# Altium project 6DOF_CONTROLLER.PrjPcb (part 2 of 2)

## Sheet MOTOR_DRIVER_CEC.SchDoc
size A4; SheetNumber: 7; SheetTotal: 12
Used 6 times, as channels U_MOTOR_DRIVER_CEC, U_MOTOR_DRIVER_CEC, U_MOTOR_DRIVER_CEC, U_MOTOR_DRIVER_CEC, U_MOTOR_DRIVER_CEC, U_MOTOR_DRIVER_CEC. Parts and nets are listed once, with the designators drawn on the sheet.
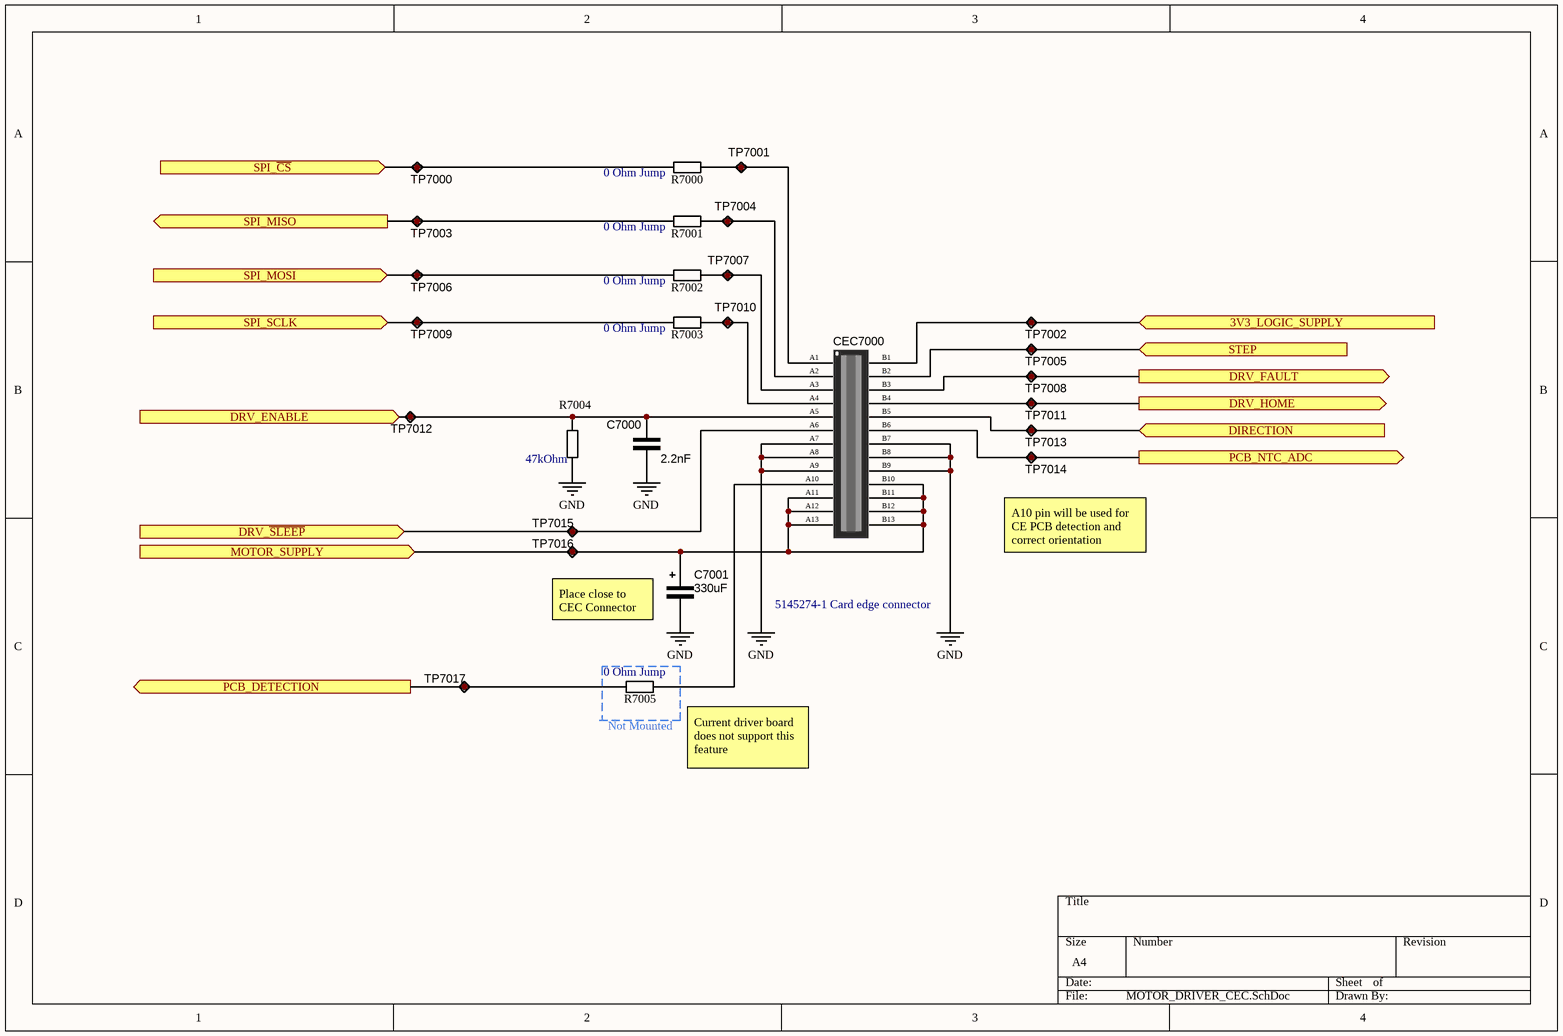
[diagram p9: MOTOR_DRIVER_CEC.SchDoc]

### Parts
C7000  2.2nF  [CAP_0603]
C7001  330uF  [CAPAE109103X103M]
CEC7000  5145274-1 Card edge connector  [5145274-1]
R7000  0 Ohm Jump  [RES_0603]
R7001  0 Ohm Jump  [RES_0603]
R7002  0 Ohm Jump  [RES_0603]
R7003  0 Ohm Jump  [RES_0603]
R7004  47kOhm  [RES_0603]
R7005  0 Ohm Jump  [RES_0603]
TP7000  Test point  [TestPoint]  (value not drawn)
TP7001  Test point  [TestPoint]  (value not drawn)
TP7002  Test point  [TestPoint]  (value not drawn)
TP7003  Test point  [TestPoint]  (value not drawn)
TP7004  Test point  [TestPoint]  (value not drawn)
TP7005  Test point  [TestPoint]  (value not drawn)
TP7006  Test point  [TestPoint]  (value not drawn)
TP7007  Test point  [TestPoint]  (value not drawn)
TP7008  Test point  [TestPoint]  (value not drawn)
TP7009  Test point  [TestPoint]  (value not drawn)
TP7010  Test point  [TestPoint]  (value not drawn)
TP7011  Test point  [TestPoint]  (value not drawn)
TP7012  Test point  [TestPoint]  (value not drawn)
TP7013  Test point  [TestPoint]  (value not drawn)
TP7014  Test point  [TestPoint]  (value not drawn)
TP7015  Test point  [TestPoint]  (value not drawn)
TP7016  Test point  [TestPoint]  (value not drawn)
TP7017  Test point  [TestPoint]  (value not drawn)

### Ports
3V3_LOGIC_SUPPLY (in, see 6DOF_CONTROLLER_Top[11C]), DIRECTION (in, see 6DOF_CONTROLLER_Top[11C]), DRV_ENABLE (in, see 6DOF_CONTROLLER_Top[11C]), DRV_FAULT (out, see 6DOF_CONTROLLER_Top[11C]), DRV_HOME (out, see 6DOF_CONTROLLER_Top[11C]), DRV_~{SLEEP} (in, see 6DOF_CONTROLLER_Top[11C]), MOTOR_SUPPLY (in, see 6DOF_CONTROLLER_Top[11C]), PCB_DETECTION (out, see 6DOF_CONTROLLER_Top[11C]), PCB_NTC_ADC (out, see 6DOF_CONTROLLER_Top[11C]), SPI_MISO (out, see 6DOF_CONTROLLER_Top[11C]), SPI_MOSI (in, see 6DOF_CONTROLLER_Top[11C]), SPI_SCLK (in, see 6DOF_CONTROLLER_Top[11C]), SPI_~{CS} (in, see 6DOF_CONTROLLER_Top[11C]), STEP (in, see 6DOF_CONTROLLER_Top[11C])

### Nets
GND: C7001.1 CEC7000.A7 CEC7000.A8 CEC7000.A9 CEC7000.B7 CEC7000.B8 CEC7000.B9
3V3_LOGIC_SUPPLY: CEC7000.B1 TP7002.1 ; port 3V3_LOGIC_SUPPLY
DIRECTION: CEC7000.B5 TP7013.1 ; port DIRECTION
DRV_ENABLE: C7000.2 CEC7000.A5 R7004.2 TP7012.1 ; port DRV_ENABLE
DRV_FAULT: CEC7000.B3 TP7008.1 ; port DRV_FAULT
DRV_HOME: CEC7000.B4 TP7011.1 ; port DRV_HOME
DRV_~{SLEEP}: CEC7000.A6 TP7015.1 ; port DRV_~{SLEEP}
MOTOR_SUPPLY: C7001.2 CEC7000.A11 CEC7000.A12 CEC7000.A13 CEC7000.B10 CEC7000.B11 CEC7000.B12 CEC7000.B13 TP7016.1 ; port MOTOR_SUPPLY
PCB_DETECTION: R7005.1 TP7017.1 ; port PCB_DETECTION
PCB_NTC_ADC: CEC7000.B6 TP7014.1 ; port PCB_NTC_ADC
SPI_~{CS}: R7000.1 TP7000.1 ; port SPI_~{CS}
SPI_MISO: R7001.1 TP7003.1 ; port SPI_MISO
SPI_MOSI: R7002.1 TP7006.1 ; port SPI_MOSI
SPI_SCLK: R7003.1 TP7009.1 ; port SPI_SCLK
STEP: CEC7000.B2 TP7005.1 ; port STEP
NetCEC7000_A1: CEC7000.A1 R7000.2 TP7001.1
NetCEC7000_A2: CEC7000.A2 R7001.2 TP7004.1
NetCEC7000_A3: CEC7000.A3 R7002.2 TP7007.1
NetCEC7000_A4: CEC7000.A4 R7003.2 TP7010.1
NetCEC7000_A10: CEC7000.A10 R7005.2

Not connected (* = marked no-connect by the designer): C7000 1; R7004 1

### Channels
U_MOTOR_DRIVER_CEC: designators end in _U_MOTOR_DRIVER_CEC#1; ports 3V3_LOGIC_SUPPLY=3V3_SYS DIRECTION=NetCEC7000_U_MOTOR_DRIVER_CEC#1_B5 DRV_ENABLE=NetC7000_U_MOTOR_DRIVER_CEC#1_2 DRV_FAULT=NetCEC7000_U_MOTOR_DRIVER_CEC#1_B3 DRV_HOME=NetCEC7000_U_MOTOR_DRIVER_CEC#1_B4 DRV_~{SLEEP}=NetCEC7000_U_MOTOR_DRIVER_CEC#1_A6 MOTOR_SUPPLY=12V_VMOT1 PCB_DETECTION=NetR7005_U_MOTOR_DRIVER_CEC#1_1 PCB_NTC_ADC=NetCEC7000_U_MOTOR_DRIVER_CEC#1_B6 SPI_MISO=NetR7001_U_MOTOR_DRIVER_CEC#1_1 SPI_MOSI=NetR7002_U_MOTOR_DRIVER_CEC#1_1 SPI_SCLK=NetR7003_U_MOTOR_DRIVER_CEC#1_1 SPI_~{CS}=NetR7000_U_MOTOR_DRIVER_CEC#1_1 STEP=NetCEC7000_U_MOTOR_DRIVER_CEC#1_B2
U_MOTOR_DRIVER_CEC: designators end in _U_MOTOR_DRIVER_CEC#2; ports 3V3_LOGIC_SUPPLY=3V3_SYS DIRECTION=NetCEC7000_U_MOTOR_DRIVER_CEC#2_B5 DRV_ENABLE=NetC7000_U_MOTOR_DRIVER_CEC#2_2 DRV_FAULT=NetCEC7000_U_MOTOR_DRIVER_CEC#2_B3 DRV_HOME=NetCEC7000_U_MOTOR_DRIVER_CEC#2_B4 DRV_~{SLEEP}=NetCEC7000_U_MOTOR_DRIVER_CEC#2_A6 MOTOR_SUPPLY=12V_VMOT1 PCB_DETECTION=NetR7005_U_MOTOR_DRIVER_CEC#2_1 PCB_NTC_ADC=NetCEC7000_U_MOTOR_DRIVER_CEC#2_B6 SPI_MISO=NetR7001_U_MOTOR_DRIVER_CEC#2_1 SPI_MOSI=NetR7002_U_MOTOR_DRIVER_CEC#2_1 SPI_SCLK=NetR7003_U_MOTOR_DRIVER_CEC#2_1 SPI_~{CS}=NetR7000_U_MOTOR_DRIVER_CEC#2_1 STEP=NetCEC7000_U_MOTOR_DRIVER_CEC#2_B2
U_MOTOR_DRIVER_CEC: designators end in _U_MOTOR_DRIVER_CEC#3; ports 3V3_LOGIC_SUPPLY=3V3_SYS DIRECTION=NetCEC7000_U_MOTOR_DRIVER_CEC#3_B5 DRV_ENABLE=NetC7000_U_MOTOR_DRIVER_CEC#3_2 DRV_FAULT=NetCEC7000_U_MOTOR_DRIVER_CEC#3_B3 DRV_HOME=NetCEC7000_U_MOTOR_DRIVER_CEC#3_B4 DRV_~{SLEEP}=NetCEC7000_U_MOTOR_DRIVER_CEC#3_A6 MOTOR_SUPPLY=12V_VMOT1 PCB_DETECTION=NetR7005_U_MOTOR_DRIVER_CEC#3_1 PCB_NTC_ADC=NetCEC7000_U_MOTOR_DRIVER_CEC#3_B6 SPI_MISO=NetR7001_U_MOTOR_DRIVER_CEC#3_1 SPI_MOSI=NetR7002_U_MOTOR_DRIVER_CEC#3_1 SPI_SCLK=NetR7003_U_MOTOR_DRIVER_CEC#3_1 SPI_~{CS}=NetR7000_U_MOTOR_DRIVER_CEC#3_1 STEP=NetCEC7000_U_MOTOR_DRIVER_CEC#3_B2
U_MOTOR_DRIVER_CEC: designators end in _U_MOTOR_DRIVER_CEC#4; ports 3V3_LOGIC_SUPPLY=3V3_SYS DIRECTION=NetCEC7000_U_MOTOR_DRIVER_CEC#4_B5 DRV_ENABLE=NetC7000_U_MOTOR_DRIVER_CEC#4_2 DRV_FAULT=NetCEC7000_U_MOTOR_DRIVER_CEC#4_B3 DRV_HOME=NetCEC7000_U_MOTOR_DRIVER_CEC#4_B4 DRV_~{SLEEP}=NetCEC7000_U_MOTOR_DRIVER_CEC#4_A6 MOTOR_SUPPLY=RP_VMOT2 PCB_DETECTION=NetR7005_U_MOTOR_DRIVER_CEC#4_1 PCB_NTC_ADC=NetCEC7000_U_MOTOR_DRIVER_CEC#4_B6 SPI_MISO=NetR7001_U_MOTOR_DRIVER_CEC#4_1 SPI_MOSI=NetR7002_U_MOTOR_DRIVER_CEC#4_1 SPI_SCLK=NetR7003_U_MOTOR_DRIVER_CEC#4_1 SPI_~{CS}=NetR7000_U_MOTOR_DRIVER_CEC#4_1 STEP=NetCEC7000_U_MOTOR_DRIVER_CEC#4_B2
U_MOTOR_DRIVER_CEC: designators end in _U_MOTOR_DRIVER_CEC#5; ports 3V3_LOGIC_SUPPLY=3V3_SYS DIRECTION=NetCEC7000_U_MOTOR_DRIVER_CEC#5_B5 DRV_ENABLE=NetC7000_U_MOTOR_DRIVER_CEC#5_2 DRV_FAULT=NetCEC7000_U_MOTOR_DRIVER_CEC#5_B3 DRV_HOME=NetCEC7000_U_MOTOR_DRIVER_CEC#5_B4 DRV_~{SLEEP}=NetCEC7000_U_MOTOR_DRIVER_CEC#5_A6 MOTOR_SUPPLY=RP_VMOT2 PCB_DETECTION=NetR7005_U_MOTOR_DRIVER_CEC#5_1 PCB_NTC_ADC=NetCEC7000_U_MOTOR_DRIVER_CEC#5_B6 SPI_MISO=NetR7001_U_MOTOR_DRIVER_CEC#5_1 SPI_MOSI=NetR7002_U_MOTOR_DRIVER_CEC#5_1 SPI_SCLK=NetR7003_U_MOTOR_DRIVER_CEC#5_1 SPI_~{CS}=NetR7000_U_MOTOR_DRIVER_CEC#5_1 STEP=NetCEC7000_U_MOTOR_DRIVER_CEC#5_B2
U_MOTOR_DRIVER_CEC: designators end in _U_MOTOR_DRIVER_CEC#6; ports 3V3_LOGIC_SUPPLY=3V3_SYS DIRECTION=NetCEC7000_U_MOTOR_DRIVER_CEC#6_B5 DRV_ENABLE=NetC7000_U_MOTOR_DRIVER_CEC#6_2 DRV_FAULT=NetCEC7000_U_MOTOR_DRIVER_CEC#6_B3 DRV_HOME=NetCEC7000_U_MOTOR_DRIVER_CEC#6_B4 DRV_~{SLEEP}=NetCEC7000_U_MOTOR_DRIVER_CEC#6_A6 MOTOR_SUPPLY=RP_VMOT2 PCB_DETECTION=NetR7005_U_MOTOR_DRIVER_CEC#6_1 PCB_NTC_ADC=NetCEC7000_U_MOTOR_DRIVER_CEC#6_B6 SPI_MISO=NetR7001_U_MOTOR_DRIVER_CEC#6_1 SPI_MOSI=NetR7002_U_MOTOR_DRIVER_CEC#6_1 SPI_SCLK=NetR7003_U_MOTOR_DRIVER_CEC#6_1 SPI_~{CS}=NetR7000_U_MOTOR_DRIVER_CEC#6_1 STEP=NetCEC7000_U_MOTOR_DRIVER_CEC#6_B2

### Notes on the sheet
- (near TP7014) A10 pin will be used for CE PCB detection and correct orientation
- Place close to CEC Connector
- (near R7005) Not Mounted
- (near R7005) Current driver board does not support this feature
- Labels drawn without touching a wire or pin: GND

### Library data of the parts
C7000 = C000006: 2200 pF ±10% 25V Ceramic Capacitor X7R 0603 (1608 Metric); ComponentLink1Description: DigiKey; ComponentLink1URL: https://www.digikey.com/en/products/detail/yageo/CC0603KRX7R8BB222/2345066; DigiKey Part Number: 311-3653-1-ND; capacitance: 2.2nF
C7001 = C000026: 330 µF 50 V Aluminum Electrolytic Capacitors Radial, Can - SMD 120mOhm @ 100kHz 2000 Hrs @ 105°C; ComponentLink1Description: DigiKey; ComponentLink1URL: https://www.digikey.com/en/products/detail/chemi-con/EMZR500ARA331MJA0G/5824768; DigiKey Part Number: 565-EMZR500ARA331MJA0GCT-ND; capacitance: 330uF
CEC7000 = 00000012: 26 Position Female Connector Non Specified - Dual Edge Gold 0.100" (2.54mm) Black; DigiKey Part Number: 5145274-1-ND; Mouser Part Number: 571-5145274-1; ComponentLink1Description: DigiKey; ComponentLink1URL: https://www.digikey.com/en/products/detail/te-connectivity-amp-connectors/5145274-1/1122000?s=N4IgTCBcDaIKwEYAscwHYkFoEgLoF8g; ComponentLink2Description: Mouser; ComponentLink2URL: https://eu.mouser.com/ProductDetail/TE-Connectivity/5145274-1?qs=2yE%2FVfFfKwpybi4w6sCxTA%3D%3D
R7000-R7003 R7005 = R000007: 0 Ohms Jumper Chip Resistor 0603 (1608 Metric) Automotive AEC-Q200 Thick Film; ComponentLink1Description: DigiKey; ComponentLink1URL: https://www.digikey.com/en/products/detail/stackpole-electronics-inc/RMCF0603ZT0R00/1756908; resistance: 0 Ohm Jump; DigiKey Part Number: RMCF0603ZT0R00CT-ND
R7004 = R000010: 47 kOhms ±1% 0.1W, 1/10W Chip Resistor 0603 (1608 Metric) Moisture Resistant Thick Film; ComponentLink1Description: DigiKey; ComponentLink1URL: https://www.digikey.com/en/products/detail/yageo/RC0603FR-0747KL/727253; resistance: 47kOhm; DigiKey Part Number: 311-47.0KHRCT-ND
TP7000-TP7017 = TP002: Test point 1mm

## Sheet 12V_VMOT_SUPPLY.SchDoc
size OrCAD C; SheetNumber: 8; SheetTotal: 12
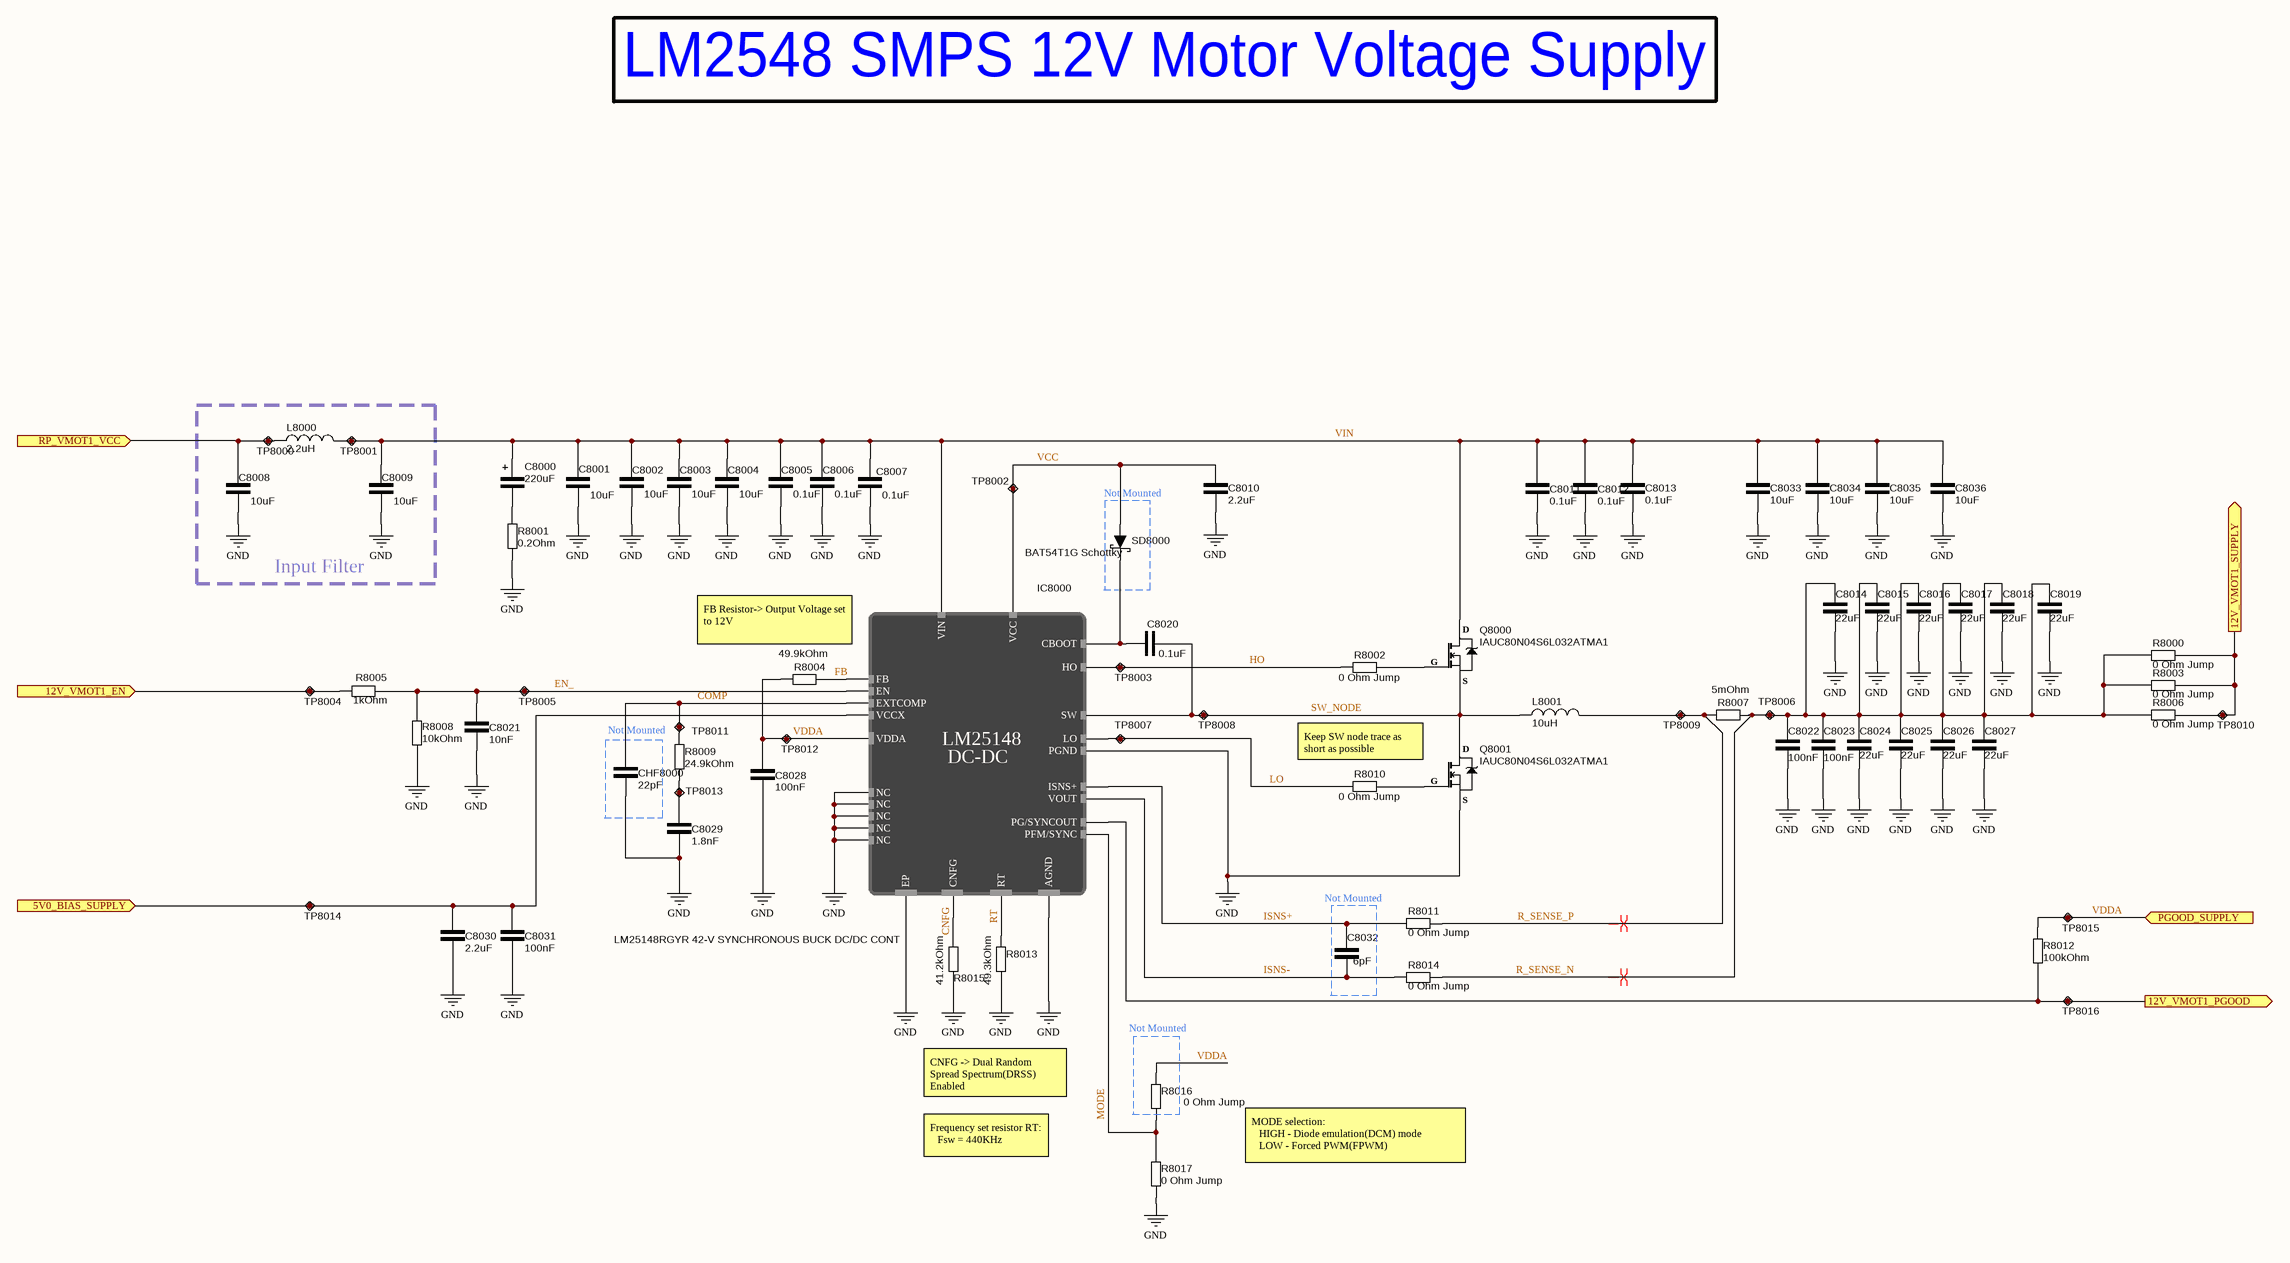
[diagram p10: 12V_VMOT_SUPPLY.SchDoc]

### Parts
C8000  220uF  [CAPAE109103X103M]
C8001  10uF  [CAP_1206]
C8002  10uF  [CAP_1206]
C8003  10uF  [CAP_1206]
C8004  10uF  [CAP_1206]
C8005  0.1uF  [CAP_0603]
C8006  0.1uF  [CAP_0603]
C8007  0.1uF  [CAP_0603]
C8008  10uF  [CAP_1206]
C8009  10uF  [CAP_1206]
C8010  2.2uF  [CAP_0603]
C8011  0.1uF  [CAP_0603]
C8012  0.1uF  [CAP_0603]
C8013  0.1uF  [CAP_0603]
C8014  22uF  [CAP_1210]
C8015  22uF  [CAP_1210]
C8016  22uF  [CAP_1210]
C8017  22uF  [CAP_1210]
C8018  22uF  [CAP_1210]
C8019  22uF  [CAP_1210]
C8020  0.1uF  [CAP_0603]
C8021  10nF  [CAP_0603]
C8022  100nF  [CAP_0603]
C8023  100nF  [CAP_0603]
C8024  22uF  [CAP_1210]
C8025  22uF  [CAP_1210]
C8026  22uF  [CAP_1210]
C8027  22uF  [CAP_1210]
C8028  100nF  [CAP_0603]
C8029  1.8nF  [CAP_0603]
C8030  2.2uF  [CAP_0603]
C8031  100nF  [CAP_0603]
C8032  6pF  [CAP_0402]
C8033  10uF  [CAP_1206]
C8034  10uF  [CAP_1206]
C8035  10uF  [CAP_1206]
C8036  10uF  [CAP_1206]
CHF8000  22pF  [CAP_0603]
IC8000  LM25148RGYR 42-V SYNCHRONOUS BUCK DC/DC CONT  [VQFN25_RGY_TEX]
L8000  2.2uH  [IHLP-3232DZ-51]
L8001  10uH  [INDP135126X65N]
Q8000  IAUC80N04S6L032ATMA1  [PG-TDSON-8-33]
Q8001  IAUC80N04S6L032ATMA1  [PG-TDSON-8-33]
R8000  0 Ohm Jump  [RES_1206]
R8001  0.2Ohm  [RES_1206]
R8002  0 Ohm Jump  [RES_0402]
R8003  0 Ohm Jump  [RES_1206]
R8004  49.9kOhm  [RES_0603]
R8005  1kOhm  [RES_0603]
R8006  0 Ohm Jump  [RES_1206]
R8007  5mOhm  [RES_1020_WIDE]
R8008  10kOhm  [RES_0603]
R8009  24.9kOhm  [RES_0603]
R8010  0 Ohm Jump  [RES_0402]
R8011  0 Ohm Jump  [RES_0402]
R8012  100kOhm  [RES_0603]
R8013  49.3kOhm  [RES_0603]
R8014  0 Ohm Jump  [RES_0402]
R8015  41.2kOhm  [RES_0603]
R8016  0 Ohm Jump  [RES_0603]
R8017  0 Ohm Jump  [RES_0603]
SD8000  BAT54T1G Schottky  [SODFL371X135-2N]
TP8000  Test point  [TestPoint]  (value not drawn)
TP8001  Test point  [TestPoint]  (value not drawn)
TP8002  Test point  [TestPoint]  (value not drawn)
TP8003  Test point  [TestPoint]  (value not drawn)
TP8004  Test point  [TestPoint]  (value not drawn)
TP8005  Test point  [TestPoint]  (value not drawn)
TP8006  Test point  [TestPoint]  (value not drawn)
TP8007  Test point  [TestPoint]  (value not drawn)
TP8008  Test point  [TestPoint]  (value not drawn)
TP8009  Test point  [TestPoint]  (value not drawn)
TP8010  Test point  [TestPoint]  (value not drawn)
TP8011  Test point  [TestPoint]  (value not drawn)
TP8012  Test point  [TestPoint]  (value not drawn)
TP8013  Test point  [TestPoint]  (value not drawn)
TP8014  Test point  [TestPoint]  (value not drawn)
TP8015  Test point  [TestPoint]  (value not drawn)
TP8016  Test point  [TestPoint]  (value not drawn)

### Blocks framed on the sheet
Input Filter: C8008 C8009 L8000 TP8000 TP8001
Not Mounted: SD8000
Not Mounted: CHF8000

### Ports
5V0_BIAS_SUPPLY (in, see 6DOF_CONTROLLER_Top[6A]), 12V_VMOT1_EN (in, see 6DOF_CONTROLLER_Top[6A]), 12V_VMOT1_PGOOD (out, see 6DOF_CONTROLLER_Top[7A]), 12V_VMOT1_SUPPLY (out, see 6DOF_CONTROLLER_Top[7A]), PGOOD_SUPPLY (in, see 6DOF_CONTROLLER_Top[6A], 3V3_SYS_SUPPLY[1C], 5V0_EXT_SUPPLY[1C]), RP_VMOT1_VCC (in, see 6DOF_CONTROLLER_Top[6A])

### Nets
5V0_SYS: C8030.1 C8031.2 IC8000.16(VCCX) TP8014.1 ; port 5V0_BIAS_SUPPLY
12V_VMOT1: R8000.2 R8003.2 R8006.2 TP8010.1 ; port 12V_VMOT1_SUPPLY
GND: C8001.1 C8002.2 C8003.2 C8004.2 C8005.2 C8006.2 C8007.1 C8008.1 C8009.1 C8010.1 C8011.1 C8012.1 C8013.2 C8014.1 C8015.2 C8016.1 C8017.1 C8018.2 C8019.1 C8021.1 C8022.1 C8023.1 C8024.2 C8025.2 C8026.1 C8027.2 C8028.1 C8029.1 C8030.2 C8031.1 C8033.1 C8034.1 C8035.1 C8036.1 CHF8000.1 IC8000.1(NC) IC8000.2(NC) IC8000.7(AGND) IC8000.10(PGND) IC8000.22(NC) IC8000.23(NC) IC8000.24(NC) IC8000.25(EP) Q8001.S(Source) R8001.1 R8008.1 R8013.1 R8015.1 R8017.1
RP_VMOT1: C8008.2 L8000.1 TP8000.1 ; port RP_VMOT1_VCC
VDDA: C8028.2 IC8000.8(VDDA) R8004.1 R8012.2 R8016.2 TP8012.1 TP8015.1 ; port PGOOD_SUPPLY  [project net 3V3_uC]
12V_VMOT1_EN: R8005.1 TP8004.1 ; port 12V_VMOT1_EN
12V_VMOT1_PGOOD: IC8000.17(PG/SYNCOUT) R8012.1 TP8016.1 ; port 12V_VMOT1_PGOOD
CNFG: IC8000.3(CNFG) R8015.2  [project net CNFG_8]
COMP: CHF8000.2 IC8000.5(EXTCOMP) R8009.2 TP8011.1  [project net COMP_8]
EN_: C8021.2 IC8000.19(EN) R8005.2 R8008.2 TP8005.1  [project net EN__8]
FB: IC8000.6(FB) R8004.2  [project net FB_8]
HO: IC8000.13(HO) R8002.1 TP8003.1  [project net HO_8]
ISNS+: C8032.2 IC8000.20(ISNS+) R8011.1  [project net ISNS+_8]
ISNS-: C8032.1 IC8000.21(VOUT) R8014.1  [project net ISNS-_8]
LO: IC8000.11(LO) R8010.1 TP8007.1  [project net LO_8]
MODE: IC8000.18(PFM/SYNC) R8016.1 R8017.2  [project net MODE_8]
R_SENSE_N: C8014.2 C8015.1 C8016.2 C8017.2 C8018.1 C8019.2 C8022.2 C8023.2 C8024.1 C8025.1 C8026.2 C8027.1 R8000.1 R8003.1 R8006.1 R8007.2 R8014.2 TP8006.1  [project net R_SENSE_N_8]
R_SENSE_P: L8001.2 R8007.1 R8011.2 TP8009.1  [project net R_SENSE_P_8]
RT: IC8000.4(RT) R8013.2  [project net RT_8]
SW_NODE: C8020.1 IC8000.14(SW) L8001.1 Q8000.S(Source) Q8001.D(Drain) TP8008.1  [project net SW_NODE_8]
VCC: C8010.2 IC8000.9(VCC) SD8000.1(Anode) TP8002.1  [project net VCC_8]
VIN: C8000.2 C8001.2 C8002.1 C8003.1 C8004.1 C8005.1 C8006.1 C8007.2 C8009.2 C8011.2 C8012.2 C8013.1 C8033.2 C8034.2 C8035.2 C8036.2 IC8000.12(VIN) L8000.2 Q8000.D(Drain) TP8001.1  [project net VIN_8]
NetC8000_1: C8000.1 R8001.2
NetC8020_2: C8020.2 IC8000.15(CBOOT) SD8000.2(Cathode)
NetC8029_2: C8029.2 R8009.1 TP8013.1
NetQ8000_G: Q8000.G(Gate) R8002.2
NetQ8001_G: Q8001.G(Gate) R8010.2

### Layout directives
differential pair: R_SENSE_N_8, R_SENSE_P_8

### Notes on the sheet
- LM2548 SMPS 12V Motor Voltage Supply
- (near IC8000) FB Resistor-> Output Voltage set to 12V
- Keep SW node trace as short as possible
- Not Mounted
- CNFG -> Dual Random Spread Spectrum(DRSS) Enabled
- Frequency set resistor RT:
  Fsw = 440KHz
- MODE selection:
  HIGH - Diode emulation(DCM) mode
  LOW - Forced PWM(FPWM)
- (in symbol LM25148RGYR) LM25148; DC-DC

### Library data of the parts
C8000 = C000033: 220 µF 35 V Aluminum - Polymer Capacitors Radial, Can - SMD 23mOhm 1000 Hrs @ 150°C; ComponentLink1Description: DigiKey; ComponentLink1URL: https://www.digikey.com/en/products/detail/kemet/A785MN227M1VLAS023/22003773?s=N4IgTCBcDaIIIHYAcBWAsgOTGBaCMAagDJwDKADGAMwgC6AvkA; DigiKey Part Number: 399-A785MN227M1VLAS023CT-ND; capacitance: 220uF
C8001-C8004 C8008 C8009 C8033-C8036 = C000017: 10 µF ±10% 50V Ceramic Capacitor X7R 1206 (3216 Metric); capacitance: 10uF; ComponentLink1Description: DigiKey; ComponentLink1URL: https://www.digikey.com/en/products/detail/samsung-electro-mechanics/CL31B106KBHNNNE/5961251; DigiKey Part Number: 1276-6767-1-ND
C8005-C8007 C8011-C8013 C8020 = C000018: 0.1 µF ±10% 50V Ceramic Capacitor X7R 0603 (1608 Metric); capacitance: 0.1uF; ComponentLink1Description: DigiKey; ComponentLink1URL: https://www.digikey.com/en/products/detail/samsung-electro-mechanics/CL10B104KB8NNNC/3886658; DigiKey Part Number: 1276-1000-1-ND
C8010 C8030 = C000014: 8 pF ±0.05pF 25V Ceramic Capacitor C0G, NP0 01005 (0402 Metric); ComponentLink1Description: DigiKey; ComponentLink1URL: https://www.digikey.com/en/products/detail/murata-electronics/GRM188C71C225KE11D/4905311; DigiKey Part Number: 490-12731-1-ND; capacitance: 2.2uF
C8014-C8019 C8024-C8027 = C000032: 22 µF ±10% 25V Ceramic Capacitor X7R 1210 (3225 Metric); DigiKey Part Number: 1276-3392-1-ND; ComponentLink1Description: DigiKey; ComponentLink1URL: https://www.digikey.com/en/products/detail/samsung-electro-mechanics/CL32B226KAJNNNE/3889050; capacitance: 22uF
C8021 = C000005: 10000 pF ±20% 25V Ceramic Capacitor X7R 0603 (1608 Metric); ComponentLink1Description: DigiKey; ComponentLink1URL: https://www.digikey.com/en/products/detail/kyocera-avx/06033C103MAT2A/1599370; capacitance: 10nF; DigiKey Part Number: 478-KGM15AR71E103MTCT-ND
C8022 C8023 C8028 C8031 = C000007: as C3007 on sheet 5V_SYS_SUPPLY; ComponentLink1Description: DigiKey; ComponentLink1URL: https://www.digikey.com/en/products/detail/kyocera-avx/06033C104K4T2A/8019250; capacitance: 100nF; DigiKey Part Number: 478-KAM15AR71E104KTCT-ND
C8029 = C000027: 1800 pF ±10% 25V Ceramic Capacitor X7R 0603 (1608 Metric); ComponentLink1Description: DigiKey; ComponentLink1URL: https://www.digikey.com/en/products/detail/kemet/C0603C182K3RAC7867/2200107; DigiKey Part Number: 399-15370-1-ND; capacitance: 1.8nF
C8032 = C000016: 6 pF ±0.5pF 25V Ceramic Capacitor C0G, NP0 0402 (1005 Metric); DigiKey Part Number: 399-CBR04C609D3GACCT-ND; ComponentLink1Description: DigiKey; ComponentLink1URL: https://www.digikey.com/en/products/detail/kemet/CBR04C609D3GAC/18137865?s=N4IgjCBcpgLFoDGUBmBDANgZwKYBoQB7KAbXAFYBOAJlgHYQBdAgBwBcoQBlNgJwEsAdgHMQAXwJgAbAhDJI6bPiKkQAZkphyADiasOkbnyGiJIagAZYlWfMW4CxSGSkACFgDE9IdpwCqgvxsAPIoALI4aFgArrw44gQAtNS2UHzRyk5k5ExieUA; capacitance: 6pF
CHF8000 = C000024: 22 pF ±10% 25V Ceramic Capacitor X7R 0603 (1608 Metric); capacitance: 22pF; ComponentLink1Description: DigiKey; ComponentLink1URL: https://www.digikey.com/en/products/detail/kemet/C0603C220K3RACAUTO/16524857; DigiKey Part Number: 399-C0603C220K3RACAUTOCT-ND
IC8000 = LM25148RGYR: Buck Regulator Positive Output Step-Down DC-DC Controller IC 24-VQFN (5.5x3.5); DigiKey Part Number: 296-LM25148RGYRCT-ND; Mouser Part Number: 595-LM25148RGYR; ComponentLink1Description: DigiKey; ComponentLink1URL: https://www.digikey.com/en/products/detail/texas-instruments/LM25148RGYR/15857124; ComponentLink2Description: Mouser; ComponentLink2URL: https://eu.mouser.com/ProductDetail/Texas-Instruments/LM25148RGYR?qs=doiCPypUmgEViljGB5jAZw%3D%3D
L8000 = L000015: FIXED IND 2.2UH 11.5A 12.5 MOHM; inductance: 2.2uH; DigiKey Part Number: 541-IHLP3232DZER2R2M5ACT-ND; ComponentLink1Description: DigiKey; ComponentLink1URL: https://www.digikey.com/en/products/detail/vishay-dale/IHLP3232DZER2R2M5A/4070222; case: 3232; Mouser Part Number: 70-IHLP3232DZR2R2M5A; ComponentLink2Description: Mouser; ComponentLink2URL: https://eu.mouser.com/ProductDetail/Vishay-Dale/IHLP3232DZER2R2M5A?qs=tDDpbAIEejr3%252BeiaEh99%252Bg%3D%3D
L8001 = L000016: FIXED IND 10UH 11A 15.8 MOHM SMD; inductance: 10uH; DigiKey Part Number: 553-4029-1-ND; ComponentLink1Description: DigiKey; ComponentLink1URL: https://www.digikey.com/en/products/detail/pulse-electronics/PA4343-103ANLT/7943151?s=N4IgTCBcDaIAoEEAsBmVA6AjABhQgcgDIAqIAugL5A; case: 13.5x12.6; Mouser Part Number: 673-PA4343.103ANLT; ComponentLink2Description: Mouser; ComponentLink2URL: https://eu.mouser.com/ProductDetail/Pulse-Electronics/PA4343.103ANLT?qs=chTDxNqvsym%252BWuIQdh7qfw%3D%3D
Q8000 Q8001 = 00000008: N-Channel 40 V 80A (Tc) 50W (Tc) Surface Mount PG-TDSON-8; DigiKey Part Number: 448-IAUC80N04S6L032ATMA1CT-ND; Mouser Part Number: 726-IAUC80N04S6L032A; ComponentLink1Description: DigiKey; ComponentLink1URL: https://www.digikey.com/en/products/detail/infineon-technologies/IAUC80N04S6L032ATMA1/13677609; ComponentLink2Description: Mouser; ComponentLink2URL: https://eu.mouser.com/ProductDetail/Infineon-Technologies/IAUC80N04S6L032ATMA1?qs=BJlw7L4Cy7%2F3D%2F1wP9Fszw%3D%3D; ComponentLink3Description: Footprint Drawing; ComponentLink3URL: https://www.infineon.com/cms/en/product/packages/PG-TDSON/PG-TDSON-8-33/
R8000 R8003 R8006 = R000012: 0 Ohms Jumper Chip Resistor 1206 (3216 Metric) Automotive AEC-Q200 Thick Film; ComponentLink1Description: DigiKey; ComponentLink1URL: https://www.digikey.com/en/products/detail/stackpole-electronics-inc/RMCF1206ZT0R00/1756906; resistance: 0 Ohm Jump; DigiKey Part Number: RMCF1206ZT0R00CT-ND
R8001 = R000024: 200 mOhms ±1% 0.5W, 1/2W Chip Resistor 1206 (3216 Metric) Current Sense Thick Film; ComponentLink1Description: DigiKey; ComponentLink1URL: https://www.digikey.com/en/products/detail/stackpole-electronics-inc/CSR1206FKR200/1742391?s=N4IgTCBcDaIMIGUBKBGMAGAbAMQNJI3RAF0BfIA; resistance: 0.2Ohm; DigiKey Part Number: CSR1206FKR200CT-ND
R8002 R8010 R8011 R8014 = R000008: 0 Ohms Jumper Chip Resistor 0402 (1005 Metric) Automotive AEC-Q200 Thick Film; resistance: 0 Ohm Jump; DigiKey Part Number: P0.0JCT-ND; ComponentLink1Description: DigiKey; ComponentLink1URL: https://www.digikey.com/en/products/detail/panasonic-electronic-components/ERJ-2GE0R00X/146727
R8004 = R000025: 49.9 kOhms ±1% 0.1W, 1/10W Chip Resistor 0603 (1608 Metric) Moisture Resistant Thick Film; ComponentLink1Description: DigiKey; ComponentLink1URL: https://www.digikey.com/en/products/detail/yageo/RC0603FR-0749K9L/727265; resistance: 49.9kOhm; DigiKey Part Number: 311-49.9KHRCT-ND
R8005 = R000004: 1 kOhms ±1% 0.125W, 1/8W Chip Resistor 0603 (1608 Metric) Anti-Sulfur Thin Film; resistance: 1kOhm; ComponentLink1Description: DigiKey; ComponentLink1URL: https://www.digikey.com/en/products/detail/vishay-beyschlag-draloric-bc-components/MCT06030C1001FP500/2607821; DigiKey Part Number: MCT0603-1.00K-CFCT-ND
R8007 = R000026: 5 mOhms ±1% 2W Chip Resistor Wide 2010 (5025 Metric), 1020 Anti-Sulfur, Automotive AEC-Q200, Current Sense, Moisture Resistant, Pulse Withstanding Metal Element; ComponentLink1Description: DigiKey; ComponentLink1URL: https://www.digikey.com/en/products/detail/vishay-dale/WSL10205L000FEA/9758314; resistance: 5mOhm; DigiKey Part Number: 541-10046-1-ND
R8008 = R000001: 10 kOhms ±1% 0.125W, 1/8W Chip Resistor 0603 (1608 Metric) Anti-Sulfur Thin Film; resistance: 10kOhm; ComponentLink1Description: DigiKey; ComponentLink1URL: https://www.digikey.com/en/products/detail/vishay-beyschlag-draloric-bc-components/MCT06030C1002FP500/1850440; DigiKey Part Number: MCT0603-10.0K-CFCT-ND
R8009 = R000017: 24.9 kOhms ±1% 0.1W, 1/10W Chip Resistor 0603 (1608 Metric) Automotive AEC-Q200 Thick Film; ComponentLink1Description: DigiKey; ComponentLink1URL: https://www.digikey.com/en/products/detail/panasonic-electronic-components/ERJ-3EKF2492V/196236; resistance: 24.9kOhm; DigiKey Part Number: P24.9KHCT-ND
R8012 = R000006: 100 kOhms ±1% 0.1W, 1/10W Chip Resistor 0603 (1608 Metric) Automotive AEC-Q200 Thick Film; resistance: 100kOhm; ComponentLink1Description: DigiKey; ComponentLink1URL: https://www.digikey.com/en/products/detail/stackpole-electronics-inc/RMCF0603FG100K/1713543; DigiKey Part Number: RMCF0603FG100KCT-ND
R8013 = R000023: 49.3 kOhms ±0.1% 0.1W, 1/10W Chip Resistor 0603 (1608 Metric) Thin Film; ComponentLink1Description: DigiKey; ComponentLink1URL: https://www.digikey.com/en/products/detail/yageo/RT0603BRD0749K3L/5927964; resistance: 49.3kOhm; DigiKey Part Number: 13-RT0603BRD0749K3LCT-ND
R8015 = R000015: 41.2 kOhms ±1% 0.1W, 1/10W Chip Resistor 0603 (1608 Metric) Automotive AEC-Q200 Thick Film; ComponentLink1Description: DigiKey; ComponentLink1URL: https://www.digikey.com/en/products/detail/panasonic-electronic-components/ERJ-3EKF4122V/196347; resistance: 41.2kOhm; DigiKey Part Number: P41.2KHCT-ND
R8016 R8017 = R000007: as R7000 on sheet MOTOR_DRIVER_CEC; ComponentLink1Description: DigiKey; ComponentLink1URL: https://www.digikey.com/en/products/detail/stackpole-electronics-inc/RMCF0603ZT0R00/1756908; resistance: 0 Ohm Jump; DigiKey Part Number: RMCF0603ZT0R00CT-ND
SD8000 = 00000009: Diode 30 V 200mA Surface Mount SOD-123; DigiKey Part Number: BAT54T1GOSCT-ND; ComponentLink1Description: DigiKey; ComponentLink1URL: https://www.digikey.com/en/products/detail/onsemi/BAT54T1G/918319
TP8000-TP8016 = TP002: Test point 1mm

## Sheet COOLING_FAN.SchDoc
size OrCAD B; SheetNumber: 9; SheetTotal: 12
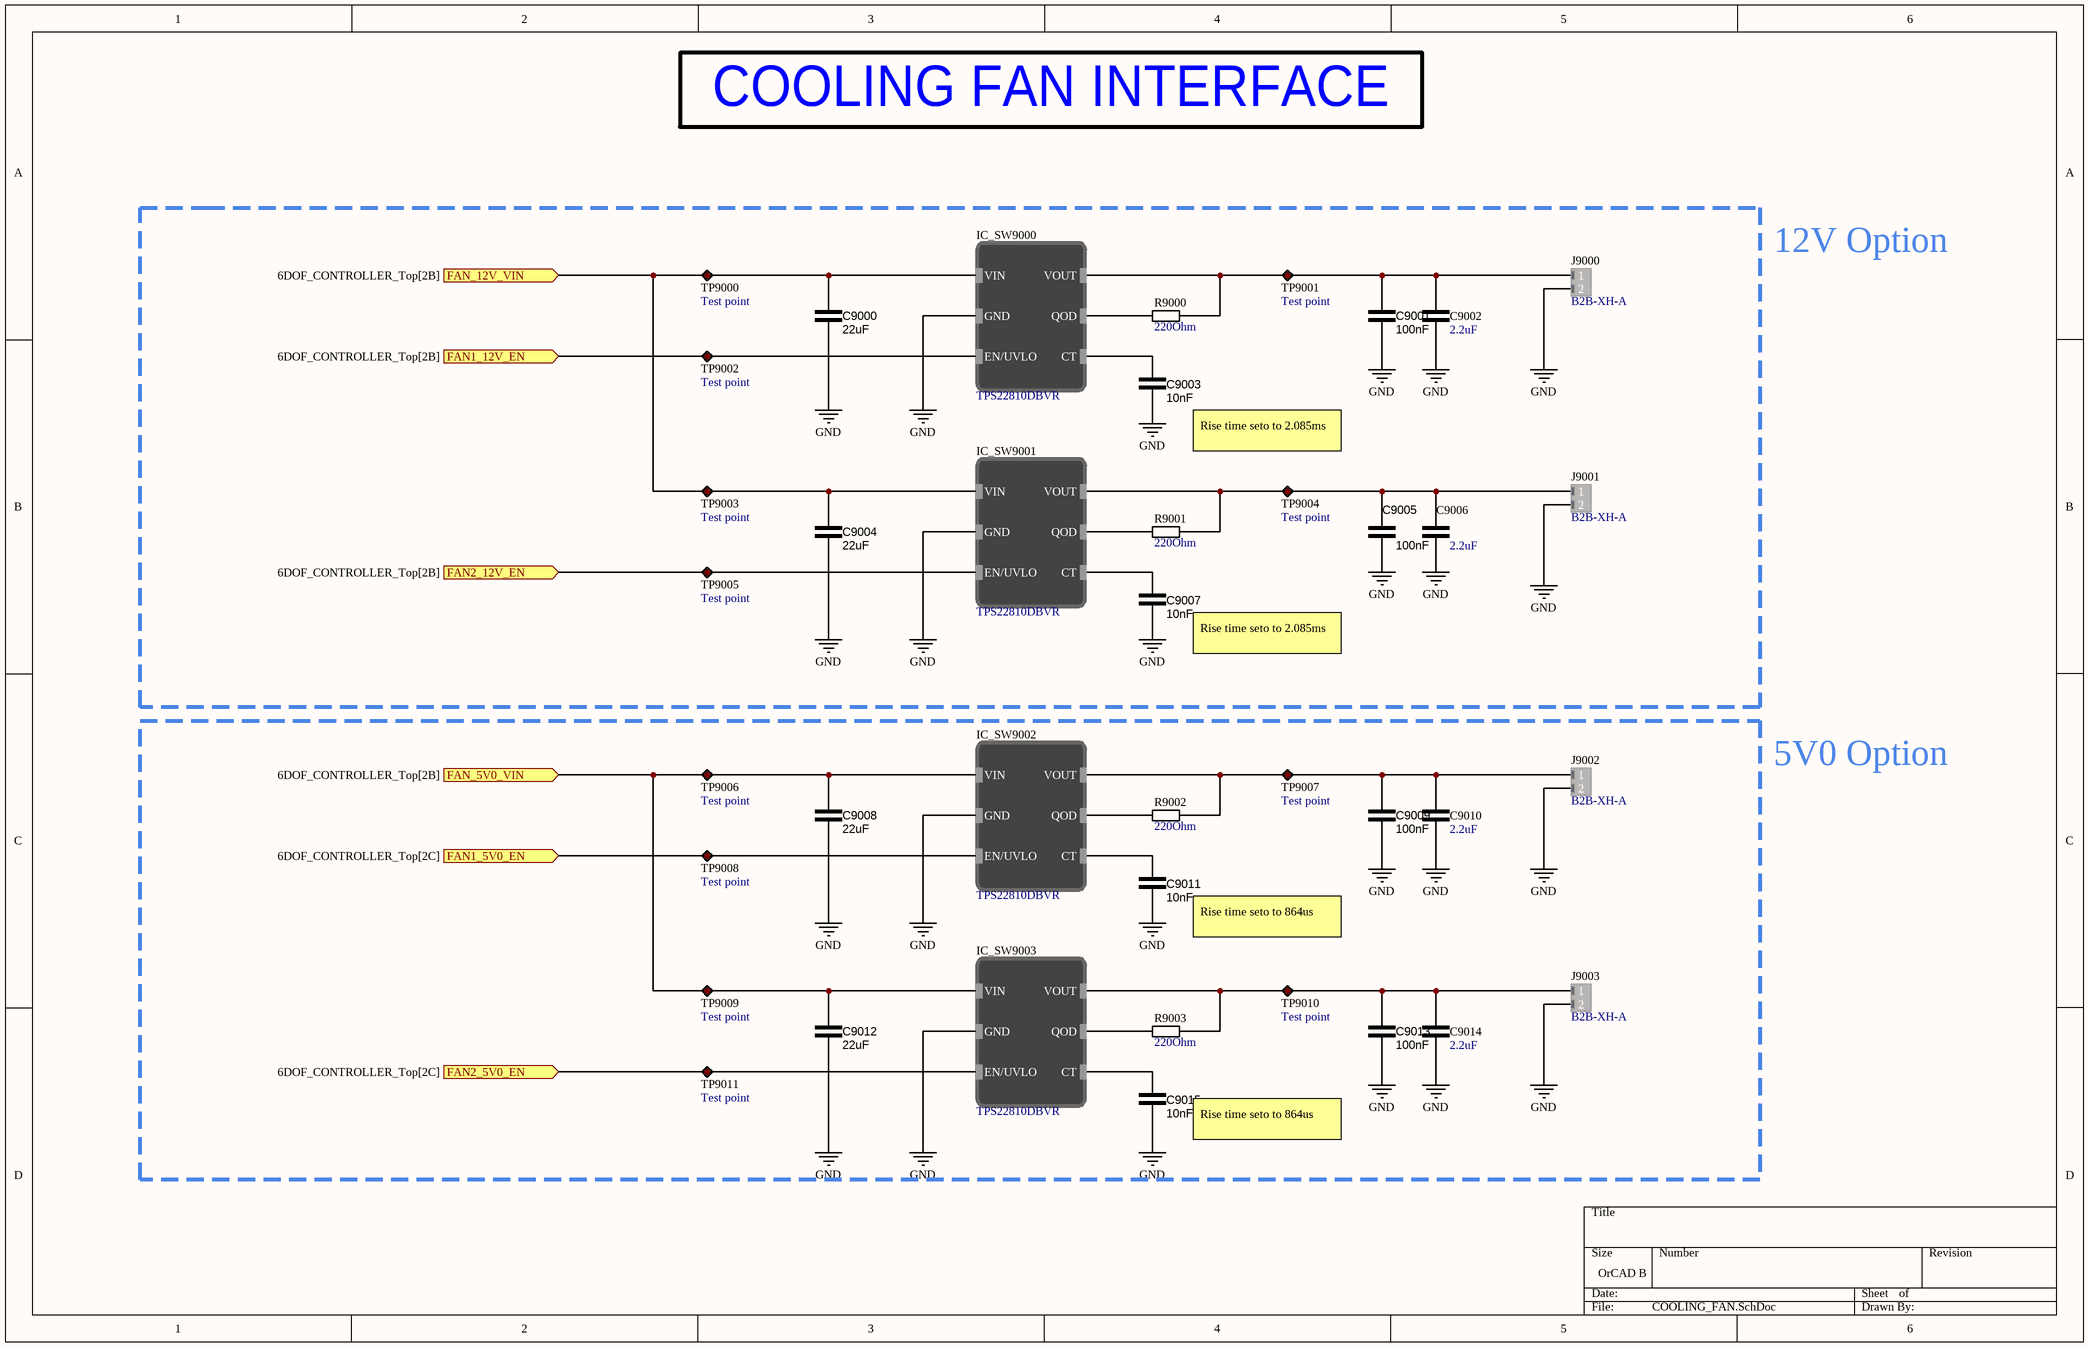
[diagram p11: COOLING_FAN.SchDoc]

### Parts
C9000  22uF  [CAP_0805]
C9001  100nF  [CAP_0603]
C9002  2.2uF  [CAP_0603]
C9003  10nF  [CAP_0603]
C9004  22uF  [CAP_0805]
C9005  100nF  [CAP_0603]
C9006  2.2uF  [CAP_0603]
C9007  10nF  [CAP_0603]
C9008  22uF  [CAP_0805]
C9009  100nF  [CAP_0603]
C9010  2.2uF  [CAP_0603]
C9011  10nF  [CAP_0603]
C9012  22uF  [CAP_0805]
C9013  100nF  [CAP_0603]
C9014  2.2uF  [CAP_0603]
C9015  10nF  [CAP_0603]
IC_SW9000  TPS22810DBVR  [SOT95P280X145-6N]
IC_SW9001  TPS22810DBVR  [SOT95P280X145-6N]
IC_SW9002  TPS22810DBVR  [SOT95P280X145-6N]
IC_SW9003  TPS22810DBVR  [SOT95P280X145-6N]
J9000  B2B-XH-A  [JST_XH_2POS]
J9001  B2B-XH-A  [JST_XH_2POS]
J9002  B2B-XH-A  [JST_XH_2POS]
J9003  B2B-XH-A  [JST_XH_2POS]
R9000  220Ohm  [RES_0603]
R9001  220Ohm  [RES_0603]
R9002  220Ohm  [RES_0603]
R9003  220Ohm  [RES_0603]
TP9000  Test point  [TestPoint]
TP9001  Test point  [TestPoint]
TP9002  Test point  [TestPoint]
TP9003  Test point  [TestPoint]
TP9004  Test point  [TestPoint]
TP9005  Test point  [TestPoint]
TP9006  Test point  [TestPoint]
TP9007  Test point  [TestPoint]
TP9008  Test point  [TestPoint]
TP9009  Test point  [TestPoint]
TP9010  Test point  [TestPoint]
TP9011  Test point  [TestPoint]

### Ports
FAN1_5V0_EN (in, see 6DOF_CONTROLLER_Top[2C]), FAN1_12V_EN (in, see 6DOF_CONTROLLER_Top[2B]), FAN2_5V0_EN (in, see 6DOF_CONTROLLER_Top[2C]), FAN2_12V_EN (in, see 6DOF_CONTROLLER_Top[2B]), FAN_5V0_VIN (in, see 6DOF_CONTROLLER_Top[2B]), FAN_12V_VIN (in, see 6DOF_CONTROLLER_Top[2B])

### Nets
5V0_EXT: C9008.2 C9012.2 IC_SW9002.1(VIN) IC_SW9003.1(VIN) TP9006.1 TP9009.1 ; port FAN_5V0_VIN
12V_VMOT1: C9000.2 C9004.2 IC_SW9000.1(VIN) IC_SW9001.1(VIN) TP9000.1 TP9003.1 ; port FAN_12V_VIN
GND: C9000.1 C9001.2 C9002.1 C9003.1 C9004.1 C9005.2 C9006.1 C9007.1 C9008.1 C9009.2 C9010.1 C9011.1 C9012.1 C9013.2 C9014.1 C9015.1 IC_SW9000.2(GND) IC_SW9001.2(GND) IC_SW9002.2(GND) IC_SW9003.2(GND) J9000.2 J9001.2 J9002.2 J9003.2
NetC9001_1: C9001.1 C9002.2 IC_SW9000.6(VOUT) J9000.1 R9000.2 TP9001.1
NetC9003_2: C9003.2 IC_SW9000.4(CT)
NetC9005_1: C9005.1 C9006.2 IC_SW9001.6(VOUT) J9001.1 R9001.2 TP9004.1
NetC9007_2: C9007.2 IC_SW9001.4(CT)
NetC9009_1: C9009.1 C9010.2 IC_SW9002.6(VOUT) J9002.1 R9002.2 TP9007.1
NetC9011_2: C9011.2 IC_SW9002.4(CT)
NetC9013_1: C9013.1 C9014.2 IC_SW9003.6(VOUT) J9003.1 R9003.2 TP9010.1
NetC9015_2: C9015.2 IC_SW9003.4(CT)
NetIC_SW9000_3: IC_SW9000.3(EN/UVLO) TP9002.1 ; port FAN1_12V_EN
NetIC_SW9000_5: IC_SW9000.5(QOD) R9000.1
NetIC_SW9001_3: IC_SW9001.3(EN/UVLO) TP9005.1 ; port FAN2_12V_EN
NetIC_SW9001_5: IC_SW9001.5(QOD) R9001.1
NetIC_SW9002_3: IC_SW9002.3(EN/UVLO) TP9008.1 ; port FAN1_5V0_EN
NetIC_SW9002_5: IC_SW9002.5(QOD) R9002.1
NetIC_SW9003_3: IC_SW9003.3(EN/UVLO) TP9011.1 ; port FAN2_5V0_EN
NetIC_SW9003_5: IC_SW9003.5(QOD) R9003.1

### Notes on the sheet
- COOLING FAN INTERFACE
- 12V Option
- Rise time seto to 2.085ms
- (near C9007) Rise time seto to 2.085ms
- 5V0 Option
- Rise time seto to 864us
- (near C9015) Rise time seto to 864us

### Library data of the parts
C9000 C9004 C9008 C9012 = C000001: 22 µF ±20% 25V Ceramic Capacitor X5R 0805 (2012 Metric); ComponentLink1Description: DigiKey; ComponentLink1URL: https://www.digikey.com/en/products/detail/tdk-corporation/C2012X5R1E226M125AC/3661564; DigiKey Part Number: 445-9112-1-ND; capacitance: 22uF
C9001 C9005 C9009 C9013 = C000007: as C3007 on sheet 5V_SYS_SUPPLY; ComponentLink1Description: DigiKey; ComponentLink1URL: https://www.digikey.com/en/products/detail/kyocera-avx/06033C104K4T2A/8019250; DigiKey Part Number: 478-KAM15AR71E104KTCT-ND; capacitance: 100nF
C9002 C9006 C9010 C9014 = C000014: as C8010 on sheet 12V_VMOT_SUPPLY; ComponentLink1Description: DigiKey; ComponentLink1URL: https://www.digikey.com/en/products/detail/murata-electronics/GRM188C71C225KE11D/4905311; DigiKey Part Number: 490-12731-1-ND; capacitance: 2.2uF
C9003 C9007 C9011 C9015 = C000005: as C8021 on sheet 12V_VMOT_SUPPLY; ComponentLink1Description: DigiKey; ComponentLink1URL: https://www.digikey.com/en/products/detail/kyocera-avx/06033C103MAT2A/1599370; DigiKey Part Number: 478-KGM15AR71E103MTCT-ND; capacitance: 10nF
IC_SW9000-IC_SW9003 = TPS22810: Power Switch/Driver 1:1 N-Channel 2A SOT-23-6; DigiKey Part Number: 296-45297-1-ND; Mouser Part Number: 595-TPS22810DBVR; ComponentLink1Description: DigiKey; ComponentLink1URL: https://www.digikey.com/en/products/detail/texas-instruments/TPS22810DBVR/6595640; ComponentLink2Description: Mouser; ComponentLink2URL: https://eu.mouser.com/ProductDetail/Texas-Instruments/TPS22810DBVR?qs=34RfhUjJmKcFqeJVMZZhPA%3D%3D
J9000-J9003 = 00000013: Connector Header Through Hole 2 position 0.098" (2.50mm); DigiKey Part Number: 455-B2B-XH-A-ND; ComponentLink1Description: DigiKey; ComponentLink1URL: https://www.digikey.com/en/products/detail/jst-sales-america-inc/B2B-XH-A/1651045
R9000-R9003 = R000021: 220 Ohms ±5% 0.1W, 1/10W Chip Resistor 0603 (1608 Metric) Automotive AEC-Q200 Thick Film; ComponentLink1Description: DigiKey; ComponentLink1URL: https://www.digikey.com/en/products/detail/panasonic-electronic-components/ERJ-3GEYJ221V/135719; resistance: 220Ohm; DigiKey Part Number: P220GCT-ND
TP9000-TP9011 = TP002: Test point 1mm

## Sheet Display_Interface.SchDoc
size A4; SheetNumber: 10; SheetTotal: 12
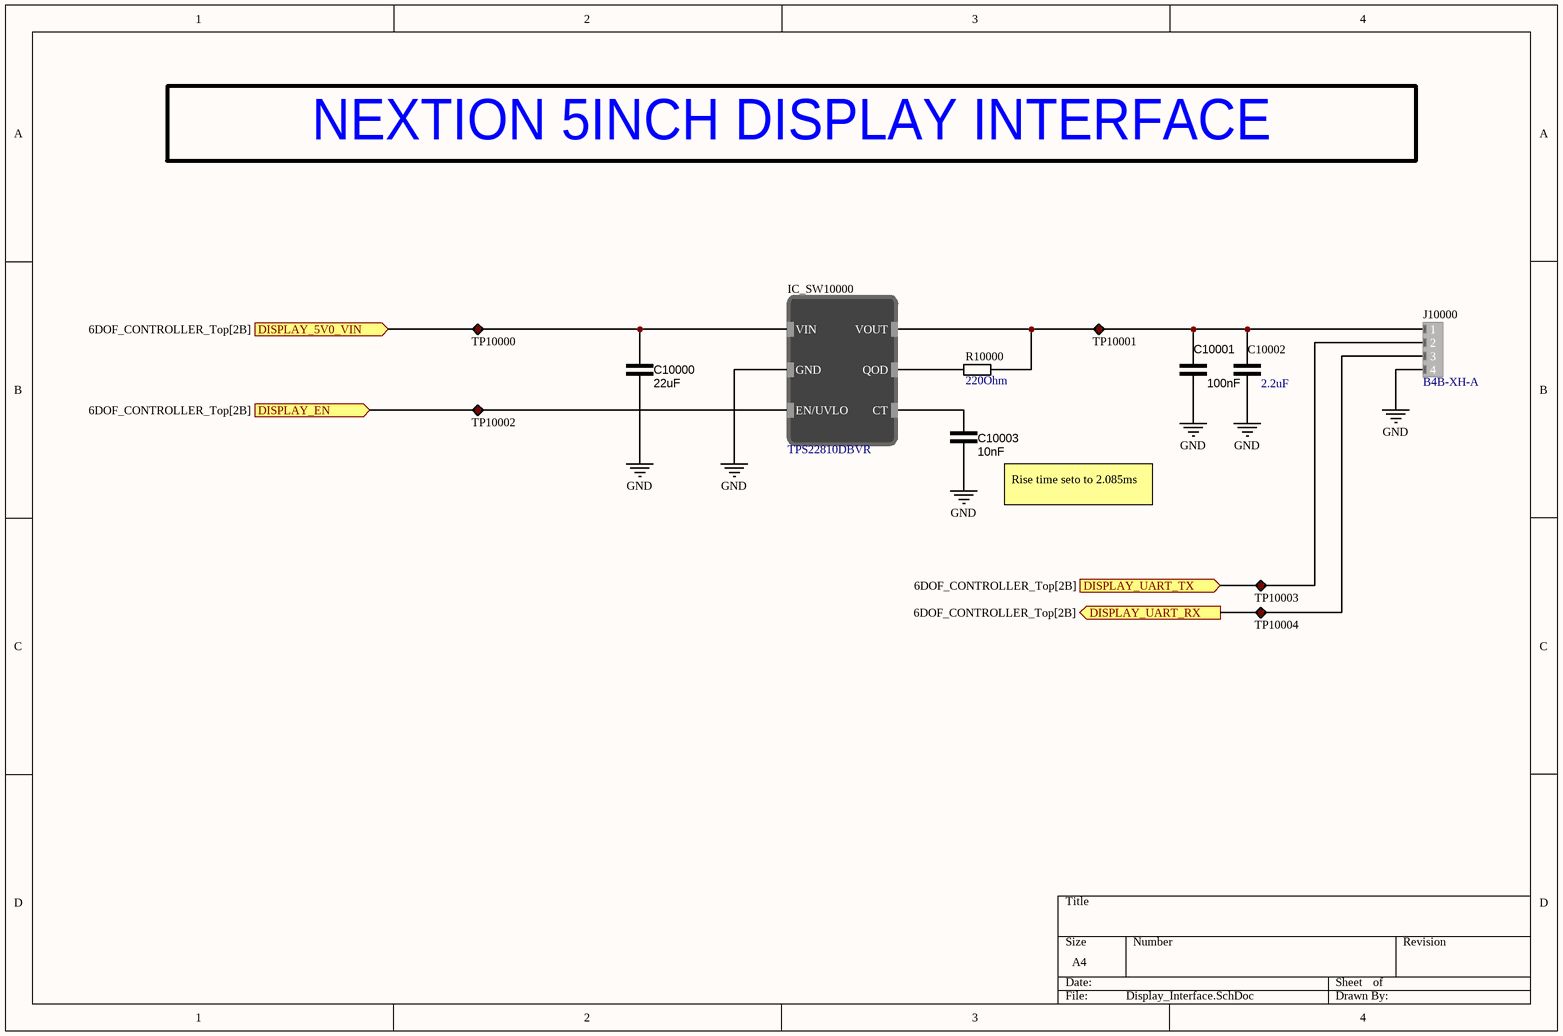
[diagram p12: Display_Interface.SchDoc]

### Parts
C10000  22uF  [CAP_0805]
C10001  100nF  [CAP_0603]
C10002  2.2uF  [CAP_0603]
C10003  10nF  [CAP_0603]
IC_SW10000  TPS22810DBVR  [SOT95P280X145-6N]
J10000  B4B-XH-A  [JST_XH_4POS]
R10000  220Ohm  [RES_0603]
TP10000  Test point  [TestPoint]  (value not drawn)
TP10001  Test point  [TestPoint]  (value not drawn)
TP10002  Test point  [TestPoint]  (value not drawn)
TP10003  Test point  [TestPoint]  (value not drawn)
TP10004  Test point  [TestPoint]  (value not drawn)

### Ports
DISPLAY_5V0_VIN (in, see 6DOF_CONTROLLER_Top[2B]), DISPLAY_EN (in, see 6DOF_CONTROLLER_Top[2B]), DISPLAY_UART_RX (out, see 6DOF_CONTROLLER_Top[2B]), DISPLAY_UART_TX (in, see 6DOF_CONTROLLER_Top[2B])

### Nets
5V0_SYS: C10000.2 IC_SW10000.1(VIN) TP10000.1 ; port DISPLAY_5V0_VIN
GND: C10000.1 C10001.2 C10002.1 C10003.1 IC_SW10000.2(GND) J10000.4
NetC10001_1: C10001.1 C10002.2 IC_SW10000.6(VOUT) J10000.1 R10000.2 TP10001.1
NetC10003_2: C10003.2 IC_SW10000.4(CT)
NetIC_SW10000_3: IC_SW10000.3(EN/UVLO) TP10002.1 ; port DISPLAY_EN
NetIC_SW10000_5: IC_SW10000.5(QOD) R10000.1
NetJ10000_2: J10000.2 TP10003.1 ; port DISPLAY_UART_TX
NetJ10000_3: J10000.3 TP10004.1 ; port DISPLAY_UART_RX

### Notes on the sheet
- NEXTION 5INCH DISPLAY INTERFACE
- (near C10003) Rise time seto to 2.085ms

### Library data of the parts
C10000 = C000001: as C9000 on sheet COOLING_FAN; ComponentLink1Description: DigiKey; ComponentLink1URL: https://www.digikey.com/en/products/detail/tdk-corporation/C2012X5R1E226M125AC/3661564; DigiKey Part Number: 445-9112-1-ND; capacitance: 22uF
C10001 = C000007: as C3007 on sheet 5V_SYS_SUPPLY; ComponentLink1Description: DigiKey; ComponentLink1URL: https://www.digikey.com/en/products/detail/kyocera-avx/06033C104K4T2A/8019250; DigiKey Part Number: 478-KAM15AR71E104KTCT-ND; capacitance: 100nF
C10002 = C000014: as C8010 on sheet 12V_VMOT_SUPPLY; ComponentLink1Description: DigiKey; ComponentLink1URL: https://www.digikey.com/en/products/detail/murata-electronics/GRM188C71C225KE11D/4905311; DigiKey Part Number: 490-12731-1-ND; capacitance: 2.2uF
C10003 = C000005: as C8021 on sheet 12V_VMOT_SUPPLY; ComponentLink1Description: DigiKey; ComponentLink1URL: https://www.digikey.com/en/products/detail/kyocera-avx/06033C103MAT2A/1599370; DigiKey Part Number: 478-KGM15AR71E103MTCT-ND; capacitance: 10nF
IC_SW10000 = TPS22810: as IC_SW9000 on sheet COOLING_FAN; DigiKey Part Number: 296-45297-1-ND; Mouser Part Number: 595-TPS22810DBVR; ComponentLink1Description: DigiKey; ComponentLink1URL: https://www.digikey.com/en/products/detail/texas-instruments/TPS22810DBVR/6595640; ComponentLink2Description: Mouser; ComponentLink2URL: https://eu.mouser.com/ProductDetail/Texas-Instruments/TPS22810DBVR?qs=34RfhUjJmKcFqeJVMZZhPA%3D%3D
J10000 = 00000014: Connector Header Through Hole 4 position 0.098" (2.50mm); DigiKey Part Number: 455-B4B-XH-A-ND; ComponentLink1Description: DigiKey; ComponentLink1URL: https://www.digikey.com/en/products/detail/jst-sales-america-inc/B4B-XH-A/1651047
R10000 = R000021: as R9000 on sheet COOLING_FAN; ComponentLink1Description: DigiKey; ComponentLink1URL: https://www.digikey.com/en/products/detail/panasonic-electronic-components/ERJ-3GEYJ221V/135719; resistance: 220Ohm; DigiKey Part Number: P220GCT-ND
TP10000-TP10004 = TP002: Test point 1mm

## Sheet MICRO_SD_CARD.SchDoc
size A4; SheetNumber: 11; SheetTotal: 12
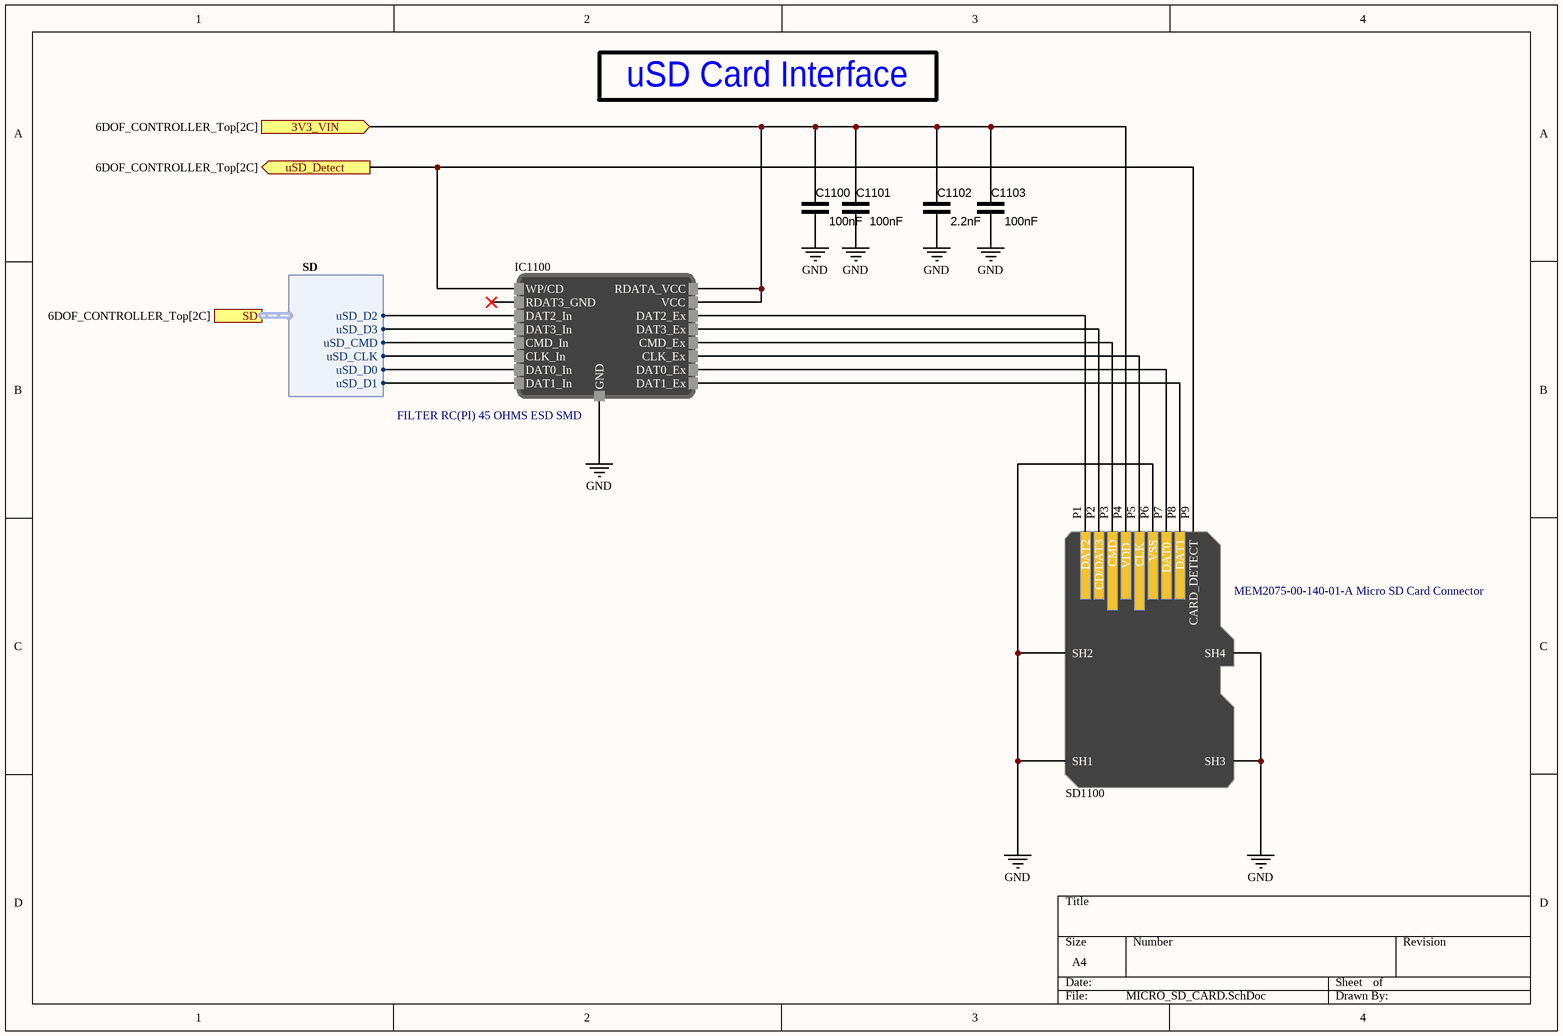
[diagram p13: MICRO_SD_CARD.SchDoc]

### Parts
C1100  100nF  [CAP_0603]
C1101  100nF  [CAP_0603]
C1102  2.2nF  [CAP_0603]
C1103  100nF  [CAP_0603]
IC1100  FILTER RC(PI) 45 OHMS ESD SMD  [Micro QFN 3.5x1.2-16L]
SD1100  MEM2075-00-140-01-A Micro SD Card Connector  [uSD_CARD_9(8+1)]

### Ports
3V3_VIN (in, see 6DOF_CONTROLLER_Top[2C]), SD (harness SD, see 6DOF_CONTROLLER_Top[2C]), uSD_Detect (out, see 6DOF_CONTROLLER_Top[2C])

### Harnesses
SD: uSD_D2, uSD_D3, uSD_CMD, uSD_CLK, uSD_D0, uSD_D1

### Nets
3V3_SYS: C1100.2 C1101.2 C1102.2 C1103.2 IC1100.15(VCC) IC1100.16(RDATA_VCC) SD1100.P4(VDD) ; port 3V3_VIN
GND: C1100.1 C1101.1 C1102.1 C1103.1 IC1100.17(GND) SD1100.P6(VSS) SD1100.SH1 SD1100.SH2 SD1100.SH3 SD1100.SH4
NetIC1100_1: IC1100.1(WP/CD) SD1100.P9(CARD_DETECT) ; port uSD_Detect
NetIC1100_3: IC1100.3(DAT2_In) ; port SD.uSD_D2
NetIC1100_4: IC1100.4(DAT3_In) ; port SD.uSD_D3
NetIC1100_5: IC1100.5(CMD_In) ; port SD.uSD_CMD
NetIC1100_6: IC1100.6(CLK_In) ; port SD.uSD_CLK
NetIC1100_7: IC1100.7(DAT0_In) ; port SD.uSD_D0
NetIC1100_8: IC1100.8(DAT1_In) ; port SD.uSD_D1
NetIC1100_9: IC1100.9(DAT1_Ex) SD1100.P8(DAT1)
NetIC1100_10: IC1100.10(DAT0_Ex) SD1100.P7(DAT0)
NetIC1100_11: IC1100.11(CLK_Ex) SD1100.P5(CLK)
NetIC1100_12: IC1100.12(CMD_Ex) SD1100.P3(CMD)
NetIC1100_13: IC1100.13(DAT3_Ex) SD1100.P2(CD/DAT3)
NetIC1100_14: IC1100.14(DAT2_Ex) SD1100.P1(DAT2)

Not connected (* = marked no-connect by the designer): IC1100 2(RDAT3_GND)*

### Notes on the sheet
- uSD Card Interface

### Library data of the parts
C1100 C1101 C1103 = C000007: as C3007 on sheet 5V_SYS_SUPPLY; ComponentLink1Description: DigiKey; ComponentLink1URL: https://www.digikey.com/en/products/detail/kyocera-avx/06033C104K4T2A/8019250; DigiKey Part Number: 478-KAM15AR71E104KTCT-ND; capacitance: 100nF
C1102 = C000006: as C7000 on sheet MOTOR_DRIVER_CEC; ComponentLink1Description: DigiKey; ComponentLink1URL: https://www.digikey.com/en/products/detail/yageo/CC0603KRX7R8BB222/2345066; DigiKey Part Number: 311-3653-1-ND; capacitance: 2.2nF
IC1100 = EMIF06-MSD02N16: RC (Pi) EMI Filter 2nd Order Low Pass 6 Channel R = 45Ohms, C = 20pF (Total) 16-UFDFN Exposed Pad; Digikey Part Number: 497-8751-1-ND; Digikey Link: https://www.digikey.com/en/products/detail/stmicroelectronics/EMIF06-MSD02N16/2043592?s=N4IgTCBcDaIKIFkCSAxADANgLQIMoBE0wA5ARgxAF0BfIA
SD1100 = 00000015: 9 (8 + 1) Position Card Connector Secure Digital - microSD™ Surface Mount, Right Angle Gold; DigiKey Part Number: 2073-MEM2075-00-140-01-ACT-ND; Mouser Part Number: 640-MEM20750014001A; ComponentLink1Description: DigiKey; ComponentLink1URL: https://www.digikey.com/en/products/detail/gct/MEM2075-00-140-01-A/9859614?s=N4IgTCBcDaILIFE5gAwHYCsBaFKsEYAWPFfLAQRAF0BfIA; ComponentLink2Description: Mouser; ComponentLink2URL: https://eu.mouser.com/ProductDetail/GCT/MEM2075-00-140-01-A?qs=KUoIvG%2F9IlZvfWpeERlq3Q%3D%3D

## Sheet MCU_SoM.SchDoc
size A2; SheetNumber: 12; SheetTotal: 12
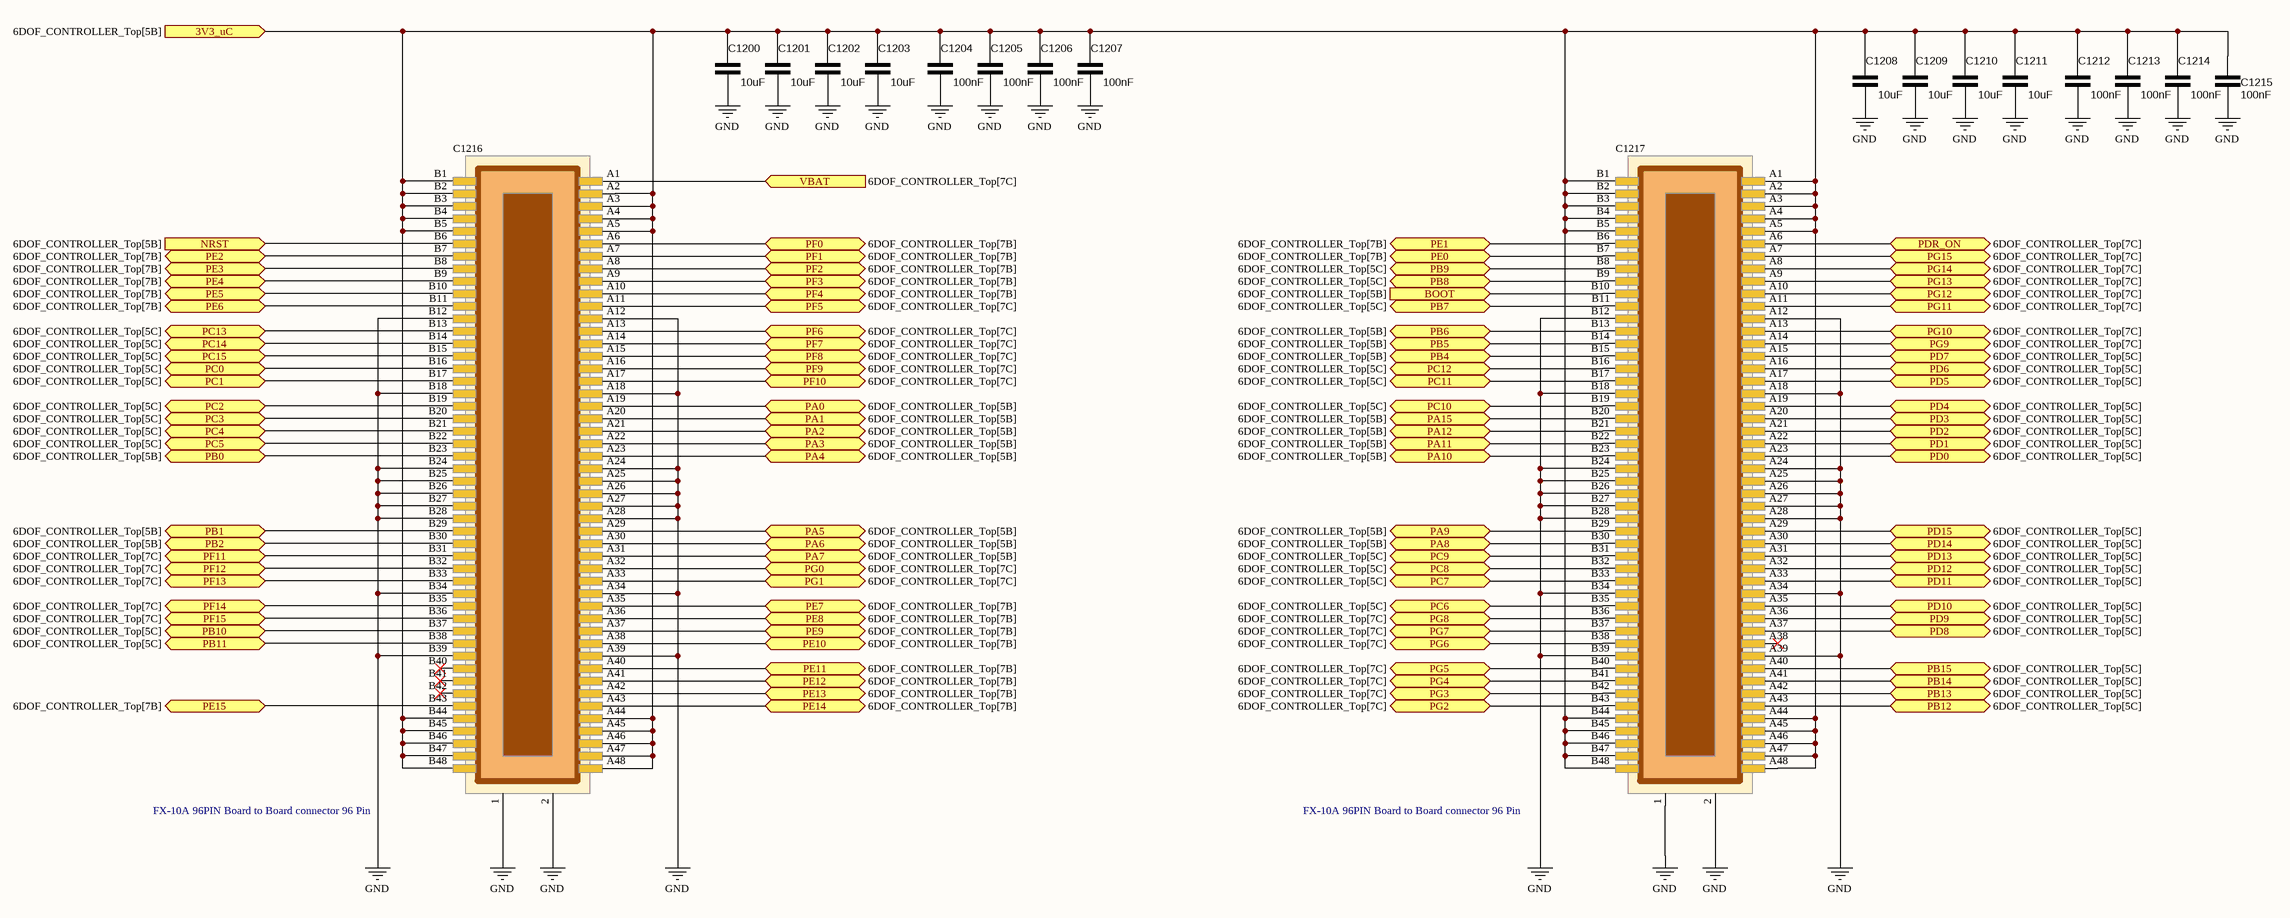
[diagram p14: MCU_SoM.SchDoc]

### Parts
C1200  10uF  [CAP_0805]
C1201  10uF  [CAP_0805]
C1202  10uF  [CAP_0805]
C1203  10uF  [CAP_0805]
C1204  100nF  [CAP_0603]
C1205  100nF  [CAP_0603]
C1206  100nF  [CAP_0603]
C1207  100nF  [CAP_0603]
C1208  10uF  [CAP_0805]
C1209  10uF  [CAP_0805]
C1210  10uF  [CAP_0805]
C1211  10uF  [CAP_0805]
C1212  100nF  [CAP_0603]
C1213  100nF  [CAP_0603]
C1214  100nF  [CAP_0603]
C1215  100nF  [CAP_0603]
C1216  FX-10A 96PIN Board to Board connector 96 Pin  [Board To Board Connector - Female]
C1217  FX-10A 96PIN Board to Board connector 96 Pin  [Board To Board Connector - Female]

### Ports
3V3_uC (in, see 6DOF_CONTROLLER_Top[5B]), BOOT (in, see 6DOF_CONTROLLER_Top[5B]), NRST (in, see 6DOF_CONTROLLER_Top[5B]), PA0 (bidir, see 6DOF_CONTROLLER_Top[5B]), PA1 (bidir, see 6DOF_CONTROLLER_Top[5B]), PA2 (bidir, see 6DOF_CONTROLLER_Top[5B]), PA3 (bidir, see 6DOF_CONTROLLER_Top[5B]), PA4 (bidir, see 6DOF_CONTROLLER_Top[5B]), PA5 (bidir, see 6DOF_CONTROLLER_Top[5B]), PA6 (bidir, see 6DOF_CONTROLLER_Top[5B]), PA7 (bidir, see 6DOF_CONTROLLER_Top[5B]), PA8 (bidir, see 6DOF_CONTROLLER_Top[5B]), PA9 (bidir, see 6DOF_CONTROLLER_Top[5B]), PA10 (bidir, see 6DOF_CONTROLLER_Top[5B]), PA11 (bidir, see 6DOF_CONTROLLER_Top[5B]), PA12 (bidir, see 6DOF_CONTROLLER_Top[5B]), PA15 (bidir, see 6DOF_CONTROLLER_Top[5B]), PB0 (bidir, see 6DOF_CONTROLLER_Top[5B]), PB1 (bidir, see 6DOF_CONTROLLER_Top[5B]), PB2 (bidir, see 6DOF_CONTROLLER_Top[5B]), PB4 (bidir, see 6DOF_CONTROLLER_Top[5B]), PB5 (bidir, see 6DOF_CONTROLLER_Top[5B]), PB6 (bidir, see 6DOF_CONTROLLER_Top[5B]), PB7 (bidir, see 6DOF_CONTROLLER_Top[5C]), PB8 (bidir, see 6DOF_CONTROLLER_Top[5C]), PB9 (bidir, see 6DOF_CONTROLLER_Top[5C]), PB10 (bidir, see 6DOF_CONTROLLER_Top[5C]), PB11 (bidir, see 6DOF_CONTROLLER_Top[5C]), PB12 (bidir, see 6DOF_CONTROLLER_Top[5C]), PB13 (bidir, see 6DOF_CONTROLLER_Top[5C]), PB14 (bidir, see 6DOF_CONTROLLER_Top[5C]), PB15 (bidir, see 6DOF_CONTROLLER_Top[5C]), PC0 (bidir, see 6DOF_CONTROLLER_Top[5C]), PC1 (bidir, see 6DOF_CONTROLLER_Top[5C]), PC2 (bidir, see 6DOF_CONTROLLER_Top[5C]), PC3 (bidir, see 6DOF_CONTROLLER_Top[5C]), PC4 (bidir, see 6DOF_CONTROLLER_Top[5C]), PC5 (bidir, see 6DOF_CONTROLLER_Top[5C]), PC6 (bidir, see 6DOF_CONTROLLER_Top[5C]), PC7 (bidir, see 6DOF_CONTROLLER_Top[5C]), PC8 (bidir, see 6DOF_CONTROLLER_Top[5C]), PC9 (bidir, see 6DOF_CONTROLLER_Top[5C]), PC10 (bidir, see 6DOF_CONTROLLER_Top[5C]), PC11 (bidir, see 6DOF_CONTROLLER_Top[5C]), PC12 (bidir, see 6DOF_CONTROLLER_Top[5C]), PC13 (bidir, see 6DOF_CONTROLLER_Top[5C]), PC14 (bidir, see 6DOF_CONTROLLER_Top[5C]), PC15 (bidir, see 6DOF_CONTROLLER_Top[5C]), PD0 (bidir, see 6DOF_CONTROLLER_Top[5C]), PD1 (bidir, see 6DOF_CONTROLLER_Top[5C]), PD2 (bidir, see 6DOF_CONTROLLER_Top[5C]), PD3 (bidir, see 6DOF_CONTROLLER_Top[5C]), PD4 (bidir, see 6DOF_CONTROLLER_Top[5C]), PD5 (bidir, see 6DOF_CONTROLLER_Top[5C]), PD6 (bidir, see 6DOF_CONTROLLER_Top[5C]), PD7 (bidir, see 6DOF_CONTROLLER_Top[5C]), PD8 (bidir, see 6DOF_CONTROLLER_Top[5C]), PD9 (bidir, see 6DOF_CONTROLLER_Top[5C]), PD10 (bidir, see 6DOF_CONTROLLER_Top[5C]), PD11 (bidir, see 6DOF_CONTROLLER_Top[5C]), PD12 (bidir, see 6DOF_CONTROLLER_Top[5C]), PD13 (bidir, see 6DOF_CONTROLLER_Top[5C]), PD14 (bidir, see 6DOF_CONTROLLER_Top[5C]), PD15 (bidir, see 6DOF_CONTROLLER_Top[5C]), PDR_ON (bidir, see 6DOF_CONTROLLER_Top[7C]), PE0 (bidir, see 6DOF_CONTROLLER_Top[7B]), PE1 (bidir, see 6DOF_CONTROLLER_Top[7B]), PE2 (bidir, see 6DOF_CONTROLLER_Top[7B]), PE3 (bidir, see 6DOF_CONTROLLER_Top[7B]), PE4 (bidir, see 6DOF_CONTROLLER_Top[7B]), PE5 (bidir, see 6DOF_CONTROLLER_Top[7B]), PE6 (bidir, see 6DOF_CONTROLLER_Top[7B]), PE7 (bidir, see 6DOF_CONTROLLER_Top[7B]), PE8 (bidir, see 6DOF_CONTROLLER_Top[7B]), PE9 (bidir, see 6DOF_CONTROLLER_Top[7B]), PE10 (bidir, see 6DOF_CONTROLLER_Top[7B]), PE11 (bidir, see 6DOF_CONTROLLER_Top[7B]), PE12 (bidir, see 6DOF_CONTROLLER_Top[7B]), PE13 (bidir, see 6DOF_CONTROLLER_Top[7B]), PE14 (bidir, see 6DOF_CONTROLLER_Top[7B]), PE15 (bidir, see 6DOF_CONTROLLER_Top[7B]), PF0 (bidir, see 6DOF_CONTROLLER_Top[7B]), PF1 (bidir, see 6DOF_CONTROLLER_Top[7B]), PF2 (bidir, see 6DOF_CONTROLLER_Top[7B]), PF3 (bidir, see 6DOF_CONTROLLER_Top[7B]), PF4 (bidir, see 6DOF_CONTROLLER_Top[7B]), PF5 (bidir, see 6DOF_CONTROLLER_Top[7C]), PF6 (bidir, see 6DOF_CONTROLLER_Top[7C]), PF7 (bidir, see 6DOF_CONTROLLER_Top[7C]), PF8 (bidir, see 6DOF_CONTROLLER_Top[7C]), PF9 (bidir, see 6DOF_CONTROLLER_Top[7C]), PF10 (bidir, see 6DOF_CONTROLLER_Top[7C]), PF11 (bidir, see 6DOF_CONTROLLER_Top[7C]), PF12 (bidir, see 6DOF_CONTROLLER_Top[7C]), PF13 (bidir, see 6DOF_CONTROLLER_Top[7C]), PF14 (bidir, see 6DOF_CONTROLLER_Top[7C]), PF15 (bidir, see 6DOF_CONTROLLER_Top[7C]), PG0 (bidir, see 6DOF_CONTROLLER_Top[7C]), PG1 (bidir, see 6DOF_CONTROLLER_Top[7C]), PG2 (bidir, see 6DOF_CONTROLLER_Top[7C]), PG3 (bidir, see 6DOF_CONTROLLER_Top[7C]), PG4 (bidir, see 6DOF_CONTROLLER_Top[7C]), PG5 (bidir, see 6DOF_CONTROLLER_Top[7C]), PG6 (bidir, see 6DOF_CONTROLLER_Top[7C]), PG7 (bidir, see 6DOF_CONTROLLER_Top[7C]), PG8 (bidir, see 6DOF_CONTROLLER_Top[7C]), PG9 (bidir, see 6DOF_CONTROLLER_Top[7C]), PG10 (bidir, see 6DOF_CONTROLLER_Top[7C]), PG11 (bidir, see 6DOF_CONTROLLER_Top[7C]), PG12 (bidir, see 6DOF_CONTROLLER_Top[7C]), PG13 (bidir, see 6DOF_CONTROLLER_Top[7C]), PG14 (bidir, see 6DOF_CONTROLLER_Top[7C]), PG15 (bidir, see 6DOF_CONTROLLER_Top[7C]), VBAT (in, see 6DOF_CONTROLLER_Top[7C])

### Nets
GND: C1200.1 C1201.1 C1202.1 C1203.1 C1204.1 C1205.1 C1206.1 C1207.1 C1208.1 C1209.1 C1210.1 C1211.1 C1212.1 C1213.1 C1214.1 C1215.1 C1216.1 C1216.2 C1216.A12 C1216.A18 C1216.A24 C1216.A25 C1216.A26 C1216.A27 C1216.A28 C1216.A34 C1216.A39 C1216.B12 C1216.B18 C1216.B24 C1216.B25 C1216.B26 C1216.B27 C1216.B28 C1216.B34 C1216.B39 C1217.1 C1217.2 C1217.A12 C1217.A18 C1217.A24 C1217.A25 C1217.A26 C1217.A27 C1217.A28 C1217.A34 C1217.A39 C1217.B12 C1217.B18 C1217.B24 C1217.B25 C1217.B26 C1217.B27 C1217.B28 C1217.B34 C1217.B39
NetC1200_2: C1200.2 C1201.2 C1202.2 C1203.2 C1204.2 C1205.2 C1206.2 C1207.2 C1208.2 C1209.2 C1210.2 C1211.2 C1212.2 C1213.2 C1214.2 C1215.2 C1216.A2 C1216.A3 C1216.A4 C1216.A5 C1216.A44 C1216.A45 C1216.A46 C1216.A47 C1216.A48 C1216.B1 C1216.B2 C1216.B3 C1216.B4 C1216.B5 C1216.B44 C1216.B45 C1216.B46 C1216.B47 C1216.B48 C1217.A1 C1217.A2 C1217.A3 C1217.A4 C1217.A5 C1217.A44 C1217.A45 C1217.A46 C1217.A47 C1217.A48 C1217.B1 C1217.B2 C1217.B3 C1217.B4 C1217.B5 C1217.B44 C1217.B45 C1217.B46 C1217.B47 C1217.B48 ; port 3V3_uC
NetC1216_A1: C1216.A1 ; port VBAT
NetC1216_A6: C1216.A6 ; port PF0
NetC1216_A7: C1216.A7 ; port PF1
NetC1216_A8: C1216.A8 ; port PF2
NetC1216_A9: C1216.A9 ; port PF3
NetC1216_A10: C1216.A10 ; port PF4
NetC1216_A11: C1216.A11 ; port PF5
NetC1216_A13: C1216.A13 ; port PF6
NetC1216_A14: C1216.A14 ; port PF7
NetC1216_A15: C1216.A15 ; port PF8
NetC1216_A16: C1216.A16 ; port PF9
NetC1216_A17: C1216.A17 ; port PF10
NetC1216_A19: C1216.A19 ; port PA0
NetC1216_A20: C1216.A20 ; port PA1
NetC1216_A21: C1216.A21 ; port PA2
NetC1216_A22: C1216.A22 ; port PA3
NetC1216_A23: C1216.A23 ; port PA4
NetC1216_A29: C1216.A29 ; port PA5
NetC1216_A30: C1216.A30 ; port PA6
NetC1216_A31: C1216.A31 ; port PA7
NetC1216_A32: C1216.A32 ; port PG0
NetC1216_A33: C1216.A33 ; port PG1
NetC1216_A35: C1216.A35 ; port PE7
NetC1216_A36: C1216.A36 ; port PE8
NetC1216_A37: C1216.A37 ; port PE9
NetC1216_A38: C1216.A38 ; port PE10
NetC1216_A40: C1216.A40 ; port PE11
NetC1216_A41: C1216.A41 ; port PE12
NetC1216_A42: C1216.A42 ; port PE13
NetC1216_A43: C1216.A43 ; port PE14
NetC1216_B6: C1216.B6 ; port NRST
NetC1216_B7: C1216.B7 ; port PE2
NetC1216_B8: C1216.B8 ; port PE3
NetC1216_B9: C1216.B9 ; port PE4
NetC1216_B10: C1216.B10 ; port PE5
NetC1216_B11: C1216.B11 ; port PE6
NetC1216_B13: C1216.B13 ; port PC13
NetC1216_B14: C1216.B14 ; port PC14
NetC1216_B15: C1216.B15 ; port PC15
NetC1216_B16: C1216.B16 ; port PC0
NetC1216_B17: C1216.B17 ; port PC1
NetC1216_B19: C1216.B19 ; port PC2
NetC1216_B20: C1216.B20 ; port PC3
NetC1216_B21: C1216.B21 ; port PC4
NetC1216_B22: C1216.B22 ; port PC5
NetC1216_B23: C1216.B23 ; port PB0
NetC1216_B29: C1216.B29 ; port PB1
NetC1216_B30: C1216.B30 ; port PB2
NetC1216_B31: C1216.B31 ; port PF11
NetC1216_B32: C1216.B32 ; port PF12
NetC1216_B33: C1216.B33 ; port PF13
NetC1216_B35: C1216.B35 ; port PF14
NetC1216_B36: C1216.B36 ; port PF15
NetC1216_B37: C1216.B37 ; port PB10
NetC1216_B38: C1216.B38 ; port PB11
NetC1216_B43: C1216.B43 ; port PE15
NetC1217_A6: C1217.A6 ; port PDR_ON
NetC1217_A7: C1217.A7 ; port PG15
NetC1217_A8: C1217.A8 ; port PG14
NetC1217_A9: C1217.A9 ; port PG13
NetC1217_A10: C1217.A10 ; port PG12
NetC1217_A11: C1217.A11 ; port PG11
NetC1217_A13: C1217.A13 ; port PG10
NetC1217_A14: C1217.A14 ; port PG9
NetC1217_A15: C1217.A15 ; port PD7
NetC1217_A16: C1217.A16 ; port PD6
NetC1217_A17: C1217.A17 ; port PD5
NetC1217_A19: C1217.A19 ; port PD4
NetC1217_A20: C1217.A20 ; port PD3
NetC1217_A21: C1217.A21 ; port PD2
NetC1217_A22: C1217.A22 ; port PD1
NetC1217_A23: C1217.A23 ; port PD0
NetC1217_A29: C1217.A29 ; port PD15
NetC1217_A30: C1217.A30 ; port PD14
NetC1217_A31: C1217.A31 ; port PD13
NetC1217_A32: C1217.A32 ; port PD12
NetC1217_A33: C1217.A33 ; port PD11
NetC1217_A35: C1217.A35 ; port PD10
NetC1217_A36: C1217.A36 ; port PD9
NetC1217_A37: C1217.A37 ; port PD8
NetC1217_A40: C1217.A40 ; port PB15
NetC1217_A41: C1217.A41 ; port PB14
NetC1217_A42: C1217.A42 ; port PB13
NetC1217_A43: C1217.A43 ; port PB12
NetC1217_B6: C1217.B6 ; port PE1
NetC1217_B7: C1217.B7 ; port PE0
NetC1217_B8: C1217.B8 ; port PB9
NetC1217_B9: C1217.B9 ; port PB8
NetC1217_B10: C1217.B10 ; port BOOT
NetC1217_B11: C1217.B11 ; port PB7
NetC1217_B13: C1217.B13 ; port PB6
NetC1217_B14: C1217.B14 ; port PB5
NetC1217_B15: C1217.B15 ; port PB4
NetC1217_B16: C1217.B16 ; port PC12
NetC1217_B17: C1217.B17 ; port PC11
NetC1217_B19: C1217.B19 ; port PC10
NetC1217_B20: C1217.B20 ; port PA15
NetC1217_B21: C1217.B21 ; port PA12
NetC1217_B22: C1217.B22 ; port PA11
NetC1217_B23: C1217.B23 ; port PA10
NetC1217_B29: C1217.B29 ; port PA9
NetC1217_B30: C1217.B30 ; port PA8
NetC1217_B31: C1217.B31 ; port PC9
NetC1217_B32: C1217.B32 ; port PC8
NetC1217_B33: C1217.B33 ; port PC7
NetC1217_B35: C1217.B35 ; port PC6
NetC1217_B36: C1217.B36 ; port PG8
NetC1217_B37: C1217.B37 ; port PG7
NetC1217_B38: C1217.B38 ; port PG6
NetC1217_B40: C1217.B40 ; port PG5
NetC1217_B41: C1217.B41 ; port PG4
NetC1217_B42: C1217.B42 ; port PG3
NetC1217_B43: C1217.B43 ; port PG2

Not connected (* = marked no-connect by the designer): C1216 B40(40)* B41(41)* B42(42)*; C1217 A38(38)*

### Library data of the parts
C1200-C1203 C1208-C1211 = C000002: 10 µF ±10% 25V Ceramic Capacitor X5R 0805 (2012 Metric); ComponentLink1Description: DigiKey; ComponentLink1URL: https://www.digikey.com/en/products/detail/tdk-corporation/C2012X5R1E106K125AB/2443462; DigiKey Part Number: 445-5984-1-ND; capacitance: 10uF
C1204-C1207 C1212-C1215 = C000007: 0.1 µF ±10% 25V Ceramic Capacitor X7R 0603 (1608 Metric); ComponentLink1Description: DigiKey; ComponentLink1URL: https://www.digikey.com/en/products/detail/kyocera-avx/06033C104K4T2A/8019250; DigiKey Part Number: 478-KAM15AR71E104KTCT-ND; capacitance: 100nF
C1216 C1217 = 00000016: CONN RCPT 96POS SMD GOLD - FEMALE; Digikey Part Number: H122463-ND; ComponentLink1Description: Digikey; ComponentLink1URL: https://www.digikey.com/en/products/detail/hirose-electric-co-ltd/FX10A-96S-SV/2041894

## Nets that join several sheets
3V3_SYS: 3V3_SYS_SUPPLY (R4001.2 R4002.2 TP4001.1), U_MOTOR_DRIVER_CEC (CEC7000_U_MOTOR_DRIVER_CEC#1.B1 TP7002_U_MOTOR_DRIVER_CEC#1.1), U_MOTOR_DRIVER_CEC (CEC7000_U_MOTOR_DRIVER_CEC#2.B1 TP7002_U_MOTOR_DRIVER_CEC#2.1), U_MOTOR_DRIVER_CEC (CEC7000_U_MOTOR_DRIVER_CEC#3.B1 TP7002_U_MOTOR_DRIVER_CEC#3.1), U_MOTOR_DRIVER_CEC (CEC7000_U_MOTOR_DRIVER_CEC#4.B1 TP7002_U_MOTOR_DRIVER_CEC#4.1), U_MOTOR_DRIVER_CEC (CEC7000_U_MOTOR_DRIVER_CEC#5.B1 TP7002_U_MOTOR_DRIVER_CEC#5.1), U_MOTOR_DRIVER_CEC (CEC7000_U_MOTOR_DRIVER_CEC#6.B1 TP7002_U_MOTOR_DRIVER_CEC#6.1), MICRO_SD_CARD (7 pins)
3V3_uC: 5V_SYS_SUPPLY (R3007.2), 3V3_SYS_SUPPLY (R4006.2), 5V0_EXT_SUPPLY (R5006.2 R5007.1), 3V3_MCU_SUPPLY (R6001.2 R6003.2 TP6000.1), 12V_VMOT_SUPPLY (7 pins)
5V0_EXT: 5V0_EXT_SUPPLY (R5001.2 R5002.2 TP5001.1), COOLING_FAN (6 pins)
5V0_SYS: 5V_SYS_SUPPLY (R3001.1 R3003.2 TP3004.1), 3V3_SYS_SUPPLY (R4000.1 R4003.1 TP4000.1), 3V3_MCU_SUPPLY (R6000.1 R6002.2 TP6001.1), 12V_VMOT_SUPPLY (C8030.1 C8031.2 IC8000.16 TP8014.1), Display_Interface (C10000.2 IC_SW10000.1 TP10000.1)
12V_VMOT1: U_MOTOR_DRIVER_CEC (9 pins), U_MOTOR_DRIVER_CEC (9 pins), U_MOTOR_DRIVER_CEC (9 pins), 12V_VMOT_SUPPLY (R8000.2 R8003.2 R8006.2 TP8010.1), COOLING_FAN (6 pins)
GND: 6DOF_CONTROLLER_Top (MAIN.3 MAIN.4), Reverse_Protection (6 pins), 5V_SYS_SUPPLY (22 pins), 3V3_SYS_SUPPLY (16 pins), 5V0_EXT_SUPPLY (14 pins), 3V3_MCU_SUPPLY (9 pins), U_MOTOR_DRIVER_CEC (7 pins), U_MOTOR_DRIVER_CEC (7 pins), U_MOTOR_DRIVER_CEC (7 pins), U_MOTOR_DRIVER_CEC (7 pins), U_MOTOR_DRIVER_CEC (7 pins), U_MOTOR_DRIVER_CEC (7 pins), 12V_VMOT_SUPPLY (49 pins), COOLING_FAN (24 pins), Display_Interface (6 pins), MICRO_SD_CARD (10 pins), MCU_SoM (56 pins)
RP_SYS_VCC: Reverse_Protection (Q1000.S ZD1000.3), 5V_SYS_SUPPLY (5 pins)
RP_VMOT1: Reverse_Protection (7 pins), 5V0_EXT_SUPPLY (R5000.1 R5003.1 TP5000.1), 12V_VMOT_SUPPLY (C8008.2 L8000.1 TP8000.1)
RP_VMOT2: Reverse_Protection (IC2000.9 Q2000.S Q2002.S), U_MOTOR_DRIVER_CEC (9 pins), U_MOTOR_DRIVER_CEC (9 pins), U_MOTOR_DRIVER_CEC (9 pins)
5V0_SYS_PGOOD: 5V_SYS_SUPPLY (IC3000.8 R3005.1 TP3007.1), 3V3_MCU_SUPPLY (R6006.1 TP6006.1)
NetC2000_2: 6DOF_CONTROLLER_Top (MAIN.1 MAIN.2), Reverse_Protection (5 pins)

## Assembly variants
ALL Components: all parts fitted
Only Populated Components: not fitted C6000 C8025 Q8001 Q8003 R5007 R6005 R7005_U_MOTOR_DRIVER_CEC1 R7005_U_MOTOR_DRIVER_CEC2 R7005_U_MOTOR_DRIVER_CEC3 R7005_U_MOTOR_DRIVER_CEC4 R7005_U_MOTOR_DRIVER_CEC5 R7005_U_MOTOR_DRIVER_CEC6 R8014